# EAGLE design dabstick_eval_rev00 (EAGLE 6.6.0)

## Sheet 1 of 4: uC
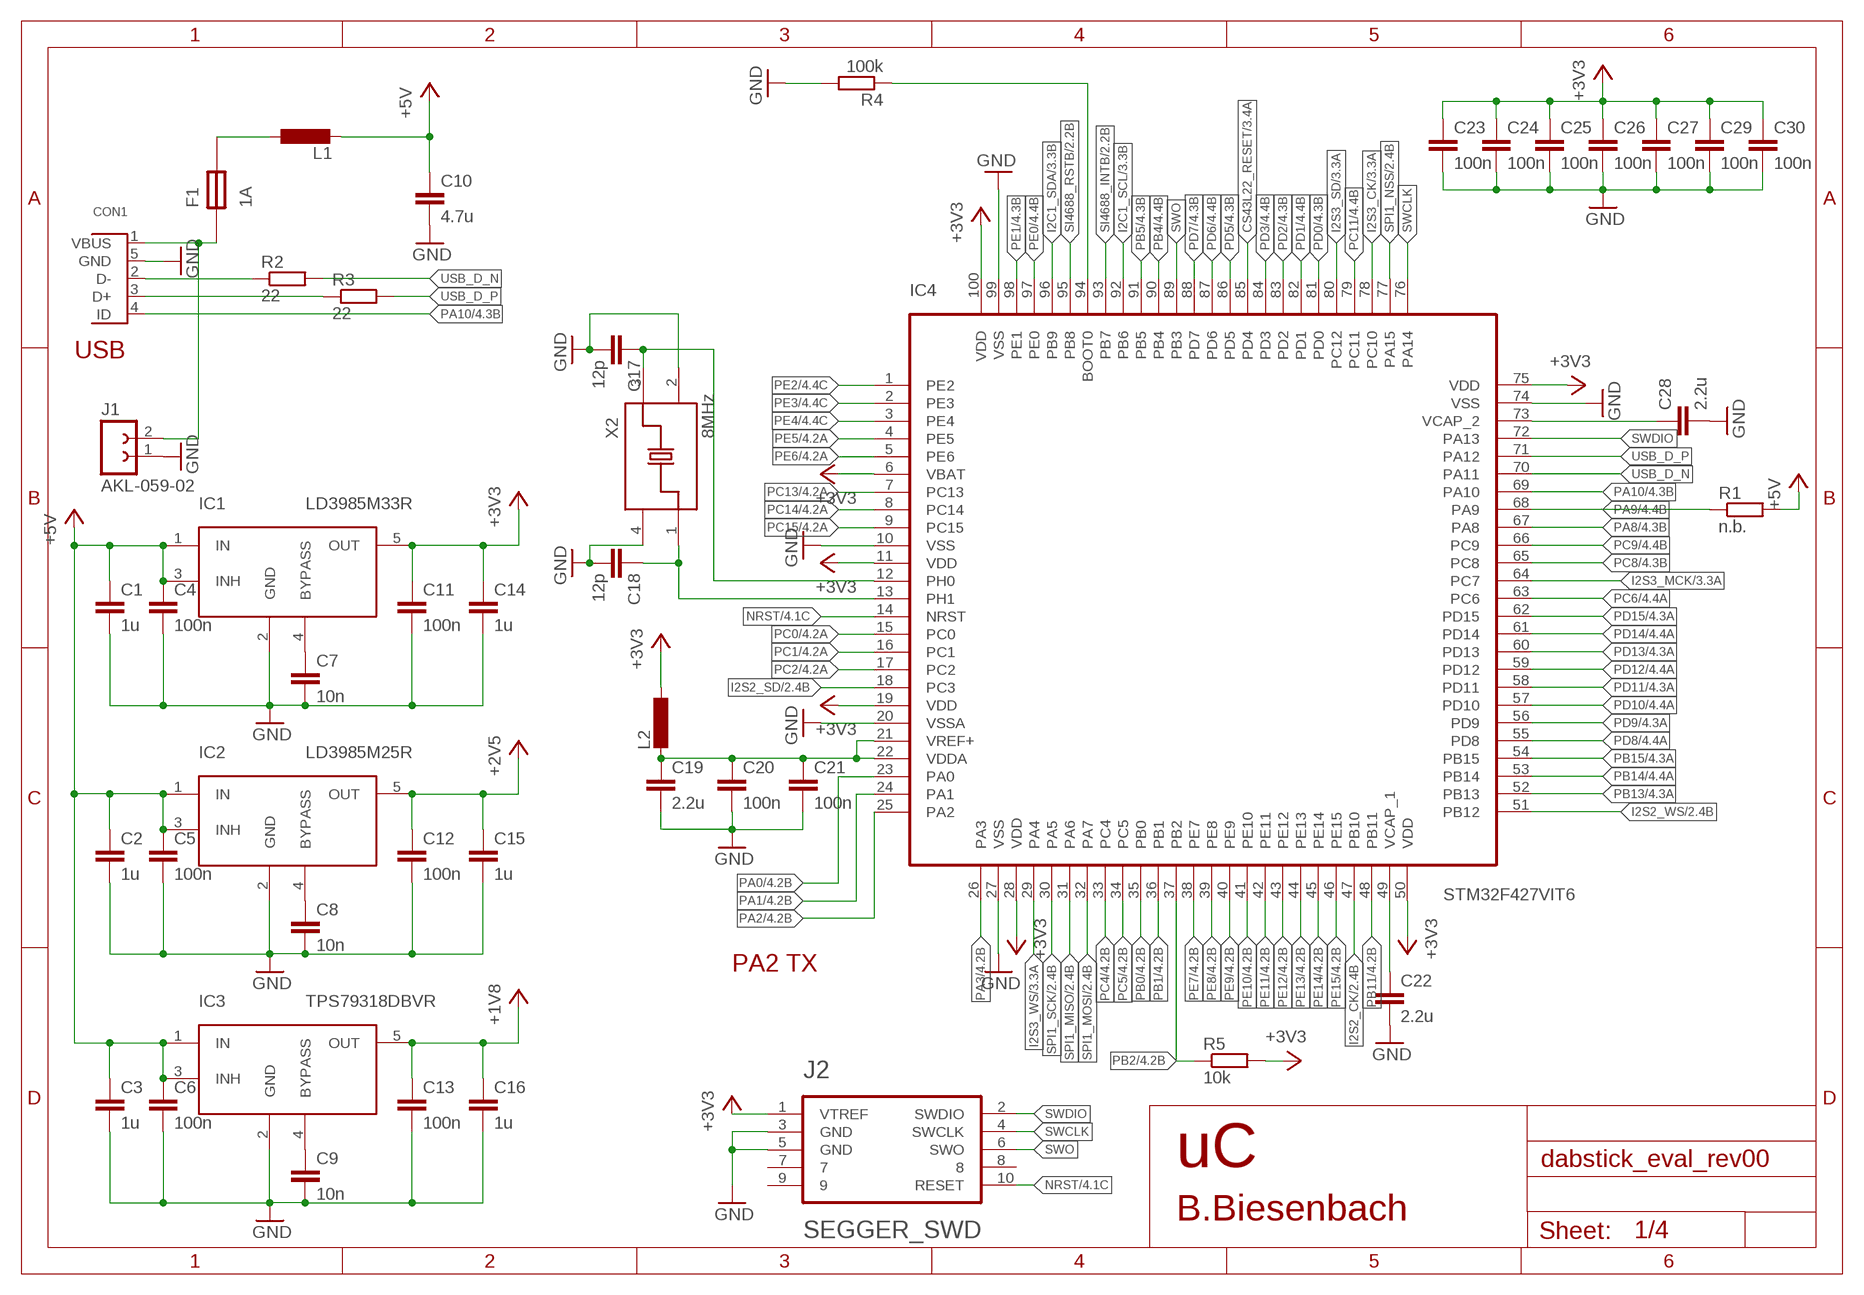
[diagram p0: schematic, sheet 1]

### Parts
C1  1u  C0603  [SMD0603]
C2  1u  C0603  [SMD0603]
C3  1u  C0603  [SMD0603]
C4  100n  C0603  [SMD0603]
C5  100n  C0603  [SMD0603]
C6  100n  C0603  [SMD0603]
C7  10n  C0603  [SMD0603]
C8  10n  C0603  [SMD0603]
C9  10n  C0603  [SMD0603]
C10  4.7u  C0805  [0805]
C11  100n  C0603  [SMD0603]
C12  100n  C0603  [SMD0603]
C13  100n  C0603  [SMD0603]
C14  1u  C0603  [SMD0603]
C15  1u  C0603  [SMD0603]
C16  1u  C0603  [SMD0603]
C17  12p  C0603  [SMD0603]
C18  12p  C0603  [SMD0603]
C19  2.2u  C0603  [SMD0603]
C20  100n  C0603  [SMD0603]
C21  100n  C0603  [SMD0603]
C22  2.2u  C0603  [SMD0603]
C23  100n  C0603  [SMD0603]
C24  100n  C0603  [SMD0603]
C25  100n  C0603  [SMD0603]
C26  100n  C0603  [SMD0603]
C27  100n  C0603  [SMD0603]
C28  2.2u  C0603  [SMD0603]
C29  100n  C0603  [SMD0603]
C30  100n  C0603  [SMD0603]
CON1  USB  [USB-B-MICRO-SMT]
F1  1A  SMD_FUSE  [SMD_FUSE]
IC1  LD3985M33R  [SOT23-5]
IC2  LD3985M25R  [SOT23-5]
IC3  TPS79318DBVR  [SOT23-5]
IC4  STM32F427VIT6  [LQFP100]
J1  AKL-059-02  [AKL-059-02]
J2  SEGGER_SWD  [HEADER_10_1.27]
L1  L08050805  [0805]
L2  L0603  [SMD0603]
R1  n.b.  R0603  [SMD0603]
R2  22  R0603  [SMD0603]
R3  22  R0603  [SMD0603]
R4  100k  R0603  [SMD0603]
R5  10k  R0603  [SMD0603]
X2  8MHz  XTAL_3.2X5  [XTAL_3.2X5]

### Nets
+1V8: C13.1 C16.1 IC3.5(OUT) ; also sheet 2
+2V5: C12.1 C15.1 IC2.5(OUT) ; also sheet 3
+3V3: C11.1 C14.1 C23.1 C24.1 C25.1 C26.1 C27.1 C29.1 C30.1 IC1.5(OUT) IC4.6(VBAT) IC4.11(VDD) IC4.19(VDD) IC4.28(VDD) IC4.50(VDD) IC4.75(VDD) IC4.100(VDD) J2.1(VTREF) L2.1 R5.2 ; also sheet 2,3,4
+5V: C1.1 C2.1 C3.1 C4.1 C5.1 C6.1 C10.1 IC1.1(IN) IC1.3(INH) IC2.1(IN) IC2.3(INH) IC3.1(IN) IC3.3(INH) L1.2 R1.2 ; also sheet 3,4
CS43L22_RESET: IC4.85(PD4) ; also sheet 3
GND: C1.2 C2.2 C3.2 C4.2 C5.2 C6.2 C7.2 C8.2 C9.2 C10.2 C11.2 C12.2 C13.2 C14.2 C15.2 C16.2 C17.2 C18.2 C19.2 C20.2 C21.2 C22.2 C23.2 C24.2 C25.2 C26.2 C27.2 C28.2 C29.2 C30.2 CON1.5(GND) IC1.2(GND) IC2.2(GND) IC3.2(GND) IC4.10(VSS) IC4.20(VSSA) IC4.27(VSS) IC4.74(VSS) IC4.99(VSS) J1.1 J2.3(GND) J2.5(GND) R4.2 X2.2(GND) X2.4(GND) ; also sheet 2,3,4
I2C1_SCL: IC4.92(PB6) ; also sheet 3
I2C1_SDA: IC4.96(PB9) ; also sheet 3
I2S2_CK: IC4.47(PB10) ; also sheet 2
I2S2_SD: IC4.18(PC3) ; also sheet 2
I2S2_WS: IC4.51(PB12) ; also sheet 2
I2S3_CK: IC4.78(PC10) ; also sheet 3
I2S3_MCK: IC4.64(PC7) ; also sheet 3
I2S3_SD: IC4.80(PC12) ; also sheet 3
I2S3_WS: IC4.29(PA4) ; also sheet 3
N$9: C7.1 IC1.4(BYPASS)
N$10: C8.1 IC2.4(BYPASS)
N$11: C9.1 IC3.4(BYPASS)
N$12: C19.1 C20.1 C21.1 IC4.21(VREF+) IC4.22(VDDA) L2.2
N$13: C28.1 IC4.73(VCAP_2)
N$14: C22.1 IC4.49(VCAP_1)
N$15: CON1.3(D+) R3.1
N$16: CON1.2(D-) R2.1
N$19: C18.1 IC4.13(PH1) X2.1
N$20: C17.1 IC4.12(PH0) X2.3
N$21: IC4.94(BOOT0) R4.1
N$30: F1.P$2 L1.1
N$31: CON1.1(VBUS) F1.P$1 J1.2
NRST: IC4.14(NRST) J2.10(RESET) ; also sheet 4
PA0: IC4.23(PA0) ; also sheet 4
PA1: IC4.24(PA1) ; also sheet 4
PA2: IC4.25(PA2) ; also sheet 4
PA3: IC4.26(PA3) ; also sheet 4
PA8: IC4.67(PA8) ; also sheet 4
PA9: IC4.68(PA9) R1.1 ; also sheet 4
PA10: CON1.4(ID) IC4.69(PA10) ; also sheet 4
PB0: IC4.35(PB0) ; also sheet 4
PB1: IC4.36(PB1) ; also sheet 4
PB2: IC4.37(PB2) R5.1 ; also sheet 4
PB4: IC4.90(PB4) ; also sheet 4
PB5: IC4.91(PB5) ; also sheet 4
PB11: IC4.48(PB11) ; also sheet 4
PB13: IC4.52(PB13) ; also sheet 4
PB14: IC4.53(PB14) ; also sheet 4
PB15: IC4.54(PB15) ; also sheet 4
PC0: IC4.15(PC0) ; also sheet 4
PC1: IC4.16(PC1) ; also sheet 4
PC2: IC4.17(PC2) ; also sheet 4
PC4: IC4.33(PC4) ; also sheet 4
PC5: IC4.34(PC5) ; also sheet 4
PC6: IC4.63(PC6) ; also sheet 4
PC8: IC4.65(PC8) ; also sheet 4
PC9: IC4.66(PC9) ; also sheet 4
PC11: IC4.79(PC11) ; also sheet 4
PC13: IC4.7(PC13) ; also sheet 4
PC14: IC4.8(PC14) ; also sheet 4
PC15: IC4.9(PC15) ; also sheet 4
PD0: IC4.81(PD0) ; also sheet 4
PD1: IC4.82(PD1) ; also sheet 4
PD2: IC4.83(PD2) ; also sheet 4
PD3: IC4.84(PD3) ; also sheet 4
PD5: IC4.86(PD5) ; also sheet 4
PD6: IC4.87(PD6) ; also sheet 4
PD7: IC4.88(PD7) ; also sheet 4
PD8: IC4.55(PD8) ; also sheet 4
PD9: IC4.56(PD9) ; also sheet 4
PD10: IC4.57(PD10) ; also sheet 4
PD11: IC4.58(PD11) ; also sheet 4
PD12: IC4.59(PD12) ; also sheet 4
PD13: IC4.60(PD13) ; also sheet 4
PD14: IC4.61(PD14) ; also sheet 4
PD15: IC4.62(PD15) ; also sheet 4
PE0: IC4.97(PE0) ; also sheet 4
PE1: IC4.98(PE1) ; also sheet 4
PE2: IC4.1(PE2) ; also sheet 4
PE3: IC4.2(PE3) ; also sheet 4
PE4: IC4.3(PE4) ; also sheet 4
PE5: IC4.4(PE5) ; also sheet 4
PE6: IC4.5(PE6) ; also sheet 4
PE7: IC4.38(PE7) ; also sheet 4
PE8: IC4.39(PE8) ; also sheet 4
PE9: IC4.40(PE9) ; also sheet 4
PE10: IC4.41(PE10) ; also sheet 4
PE11: IC4.42(PE11) ; also sheet 4
PE12: IC4.43(PE12) ; also sheet 4
PE13: IC4.44(PE13) ; also sheet 4
PE14: IC4.45(PE14) ; also sheet 4
PE15: IC4.46(PE15) ; also sheet 4
SI4688_INTB: IC4.93(PB7) ; also sheet 2
SI4688_RSTB: IC4.95(PB8) ; also sheet 2
SPI1_MISO: IC4.31(PA6) ; also sheet 2
SPI1_MOSI: IC4.32(PA7) ; also sheet 2
SPI1_NSS: IC4.77(PA15) ; also sheet 2
SPI1_SCK: IC4.30(PA5) ; also sheet 2
SWCLK: IC4.76(PA14) J2.4(SWCLK)
SWDIO: IC4.72(PA13) J2.2(SWDIO)
SWO: IC4.89(PB3) J2.6(SWO)
USB_D_N: IC4.70(PA11) R2.2
USB_D_P: IC4.71(PA12) R3.2
Unconnected: J2.7 J2.8 J2.9

### Notes on the sheet
- PA2 TX
- uC
- B.Biesenbach

## Sheet 2 of 4: DAB
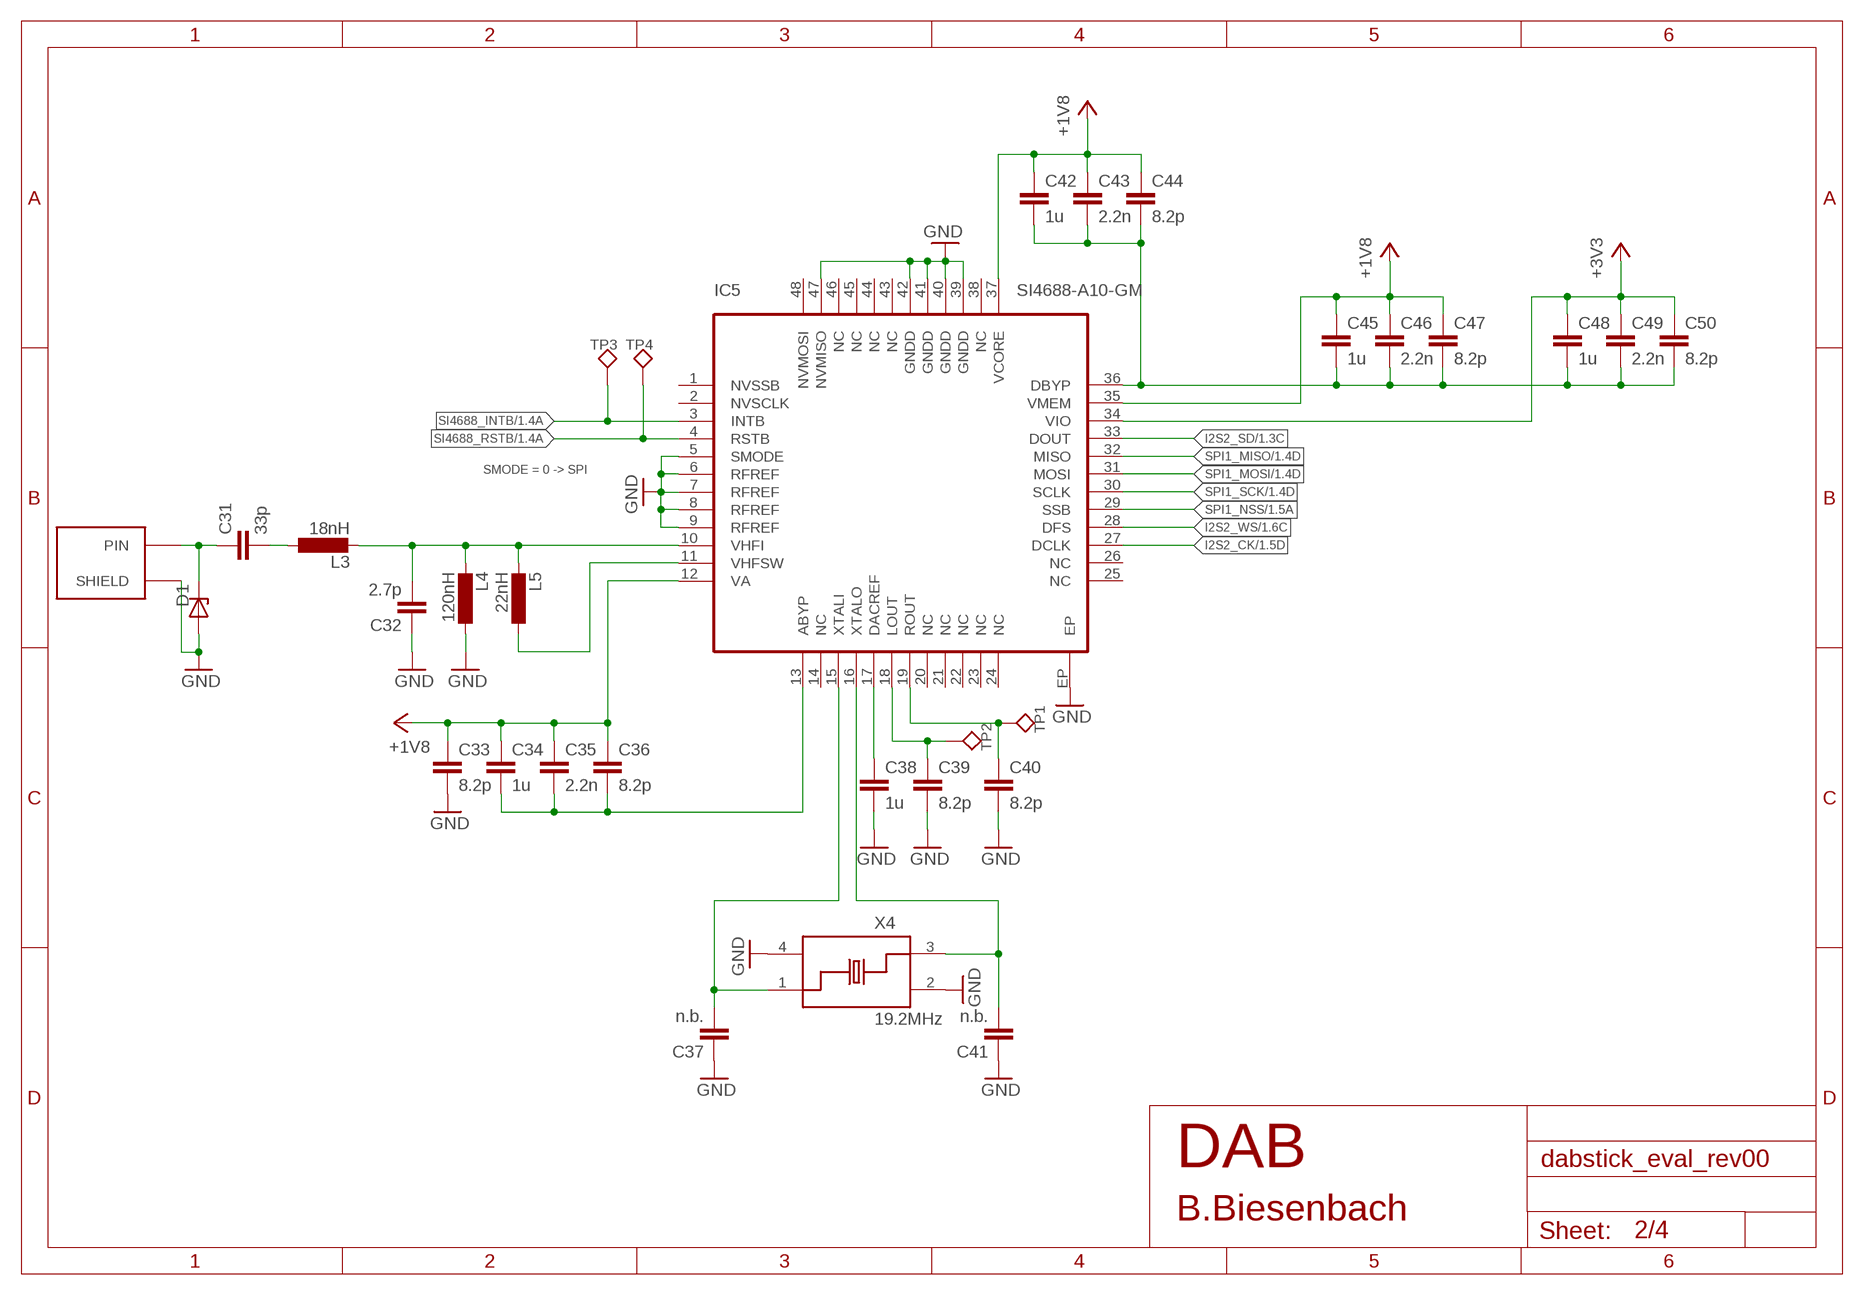
[diagram p1: schematic, sheet 2]

### Parts
C31  33p  C0402  [SMD0402]
C32  2.7p  C0402  [SMD0402]
C33  8.2p  C0603  [SMD0603]
C34  1u  C0603  [SMD0603]
C35  2.2n  C0603  [SMD0603]
C36  8.2p  C0603  [SMD0603]
C37  n.b.  C0402  [SMD0402]
C38  1u  C0603  [SMD0603]
C39  8.2p  C0603  [SMD0603]
C40  8.2p  C0603  [SMD0603]
C41  n.b.  C0402  [SMD0402]
C42  1u  C0603  [SMD0603]
C43  2.2n  C0603  [SMD0603]
C44  8.2p  C0603  [SMD0603]
C45  1u  C0603  [SMD0603]
C46  2.2n  C0603  [SMD0603]
C47  8.2p  C0603  [SMD0603]
C48  1u  C0603  [SMD0603]
C49  2.2n  C0603  [SMD0603]
C50  8.2p  C0603  [SMD0603]
D1  ESD9L5.0  [SOD923]
IC5  SI4688-A10-GM  [QFN48]
L3  18nH  L0402  [SMD0402]
L4  120nH  L0402  [SMD0402]
L5  22nH  L0402  [SMD0402]
TP1  TP-2-MM  [TP-2-MM]
TP2  TP-2-MM  [TP-2-MM]
TP3  TP-1-MM  [TP-1-MM]
TP4  TP-1-MM  [TP-1-MM]
X3  SMA_LP_1.57MM  [SMA_LP_1.57MM]
X4  19.2MHz  XTAL_3.2X2.5  [XTAL_3.2X2.5]

### Nets
+1V8: C33.1 C34.1 C35.1 C36.1 C42.1 C43.1 C44.1 C45.1 C46.1 C47.1 IC5.12(VA) IC5.35(VMEM) IC5.37(VCORE) ; also sheet 1
+3V3: C48.1 C49.1 C50.1 IC5.34(VIO) ; also sheet 1,3,4
GND: C32.1 C33.2 C37.1 C38.2 C39.2 C40.2 C41.1 D1.A IC5.5(SMODE) IC5.6(RFREF) IC5.7(RFREF) IC5.8(RFREF) IC5.9(RFREF) IC5.39(GNDD) IC5.40(GNDD) IC5.41(GNDD) IC5.42(GNDD) IC5.47(NVMISO) IC5.EP L4.1 X3.GND(SHIELD) X3.GND@1(SHIELD) X3.GND@2(SHIELD) X3.GND@3(SHIELD) X4.2(GND) X4.4(GND) ; also sheet 1,3,4
I2S2_CK: IC5.27(DCLK) ; also sheet 1
I2S2_SD: IC5.33(DOUT) ; also sheet 1
I2S2_WS: IC5.28(DFS) ; also sheet 1
N$1: C31.2 L3.1
N$2: C32.2 IC5.10(VHFI) L3.2 L4.2 L5.2
N$3: IC5.11(VHFSW) L5.1
N$4: C34.2 C35.2 C36.2 IC5.13(ABYP)
N$5: C42.2 C43.2 C44.2 C45.2 C46.2 C47.2 C48.2 C49.2 C50.2 IC5.36(DBYP)
N$6: C37.2 IC5.15(XTALI) X4.1
N$7: C41.2 IC5.16(XTALO) X4.3
N$8: C38.1 IC5.17(DACREF)
RF_IN: C31.1 D1.K(C) X3.PIN
SI4688_INTB: IC5.3(INTB) TP3.1(TP) ; also sheet 1
SI4688_LOUT: C39.1 IC5.18(LOUT) TP2.P$1(TP)
SI4688_ROUT: C40.1 IC5.19(ROUT) TP1.P$1(TP)
SI4688_RSTB: IC5.4(RSTB) TP4.1(TP) ; also sheet 1
SPI1_MISO: IC5.32(MISO) ; also sheet 1
SPI1_MOSI: IC5.31(MOSI) ; also sheet 1
SPI1_NSS: IC5.29(SSB) ; also sheet 1
SPI1_SCK: IC5.30(SCLK) ; also sheet 1
Unconnected: IC5.1(NVSSB) IC5.2(NVSCLK) IC5.14(NC) IC5.20(NC) IC5.21(NC) IC5.22(NC) IC5.23(NC) IC5.24(NC) IC5.25(NC) IC5.26(NC) IC5.38(NC) IC5.43(NC) IC5.44(NC) IC5.45(NC) IC5.46(NC) IC5.48(NVMOSI)

### Notes on the sheet
- SMODE = 0 -> SPI
- DAB
- B.Biesenbach

## Sheet 3 of 4: Audio
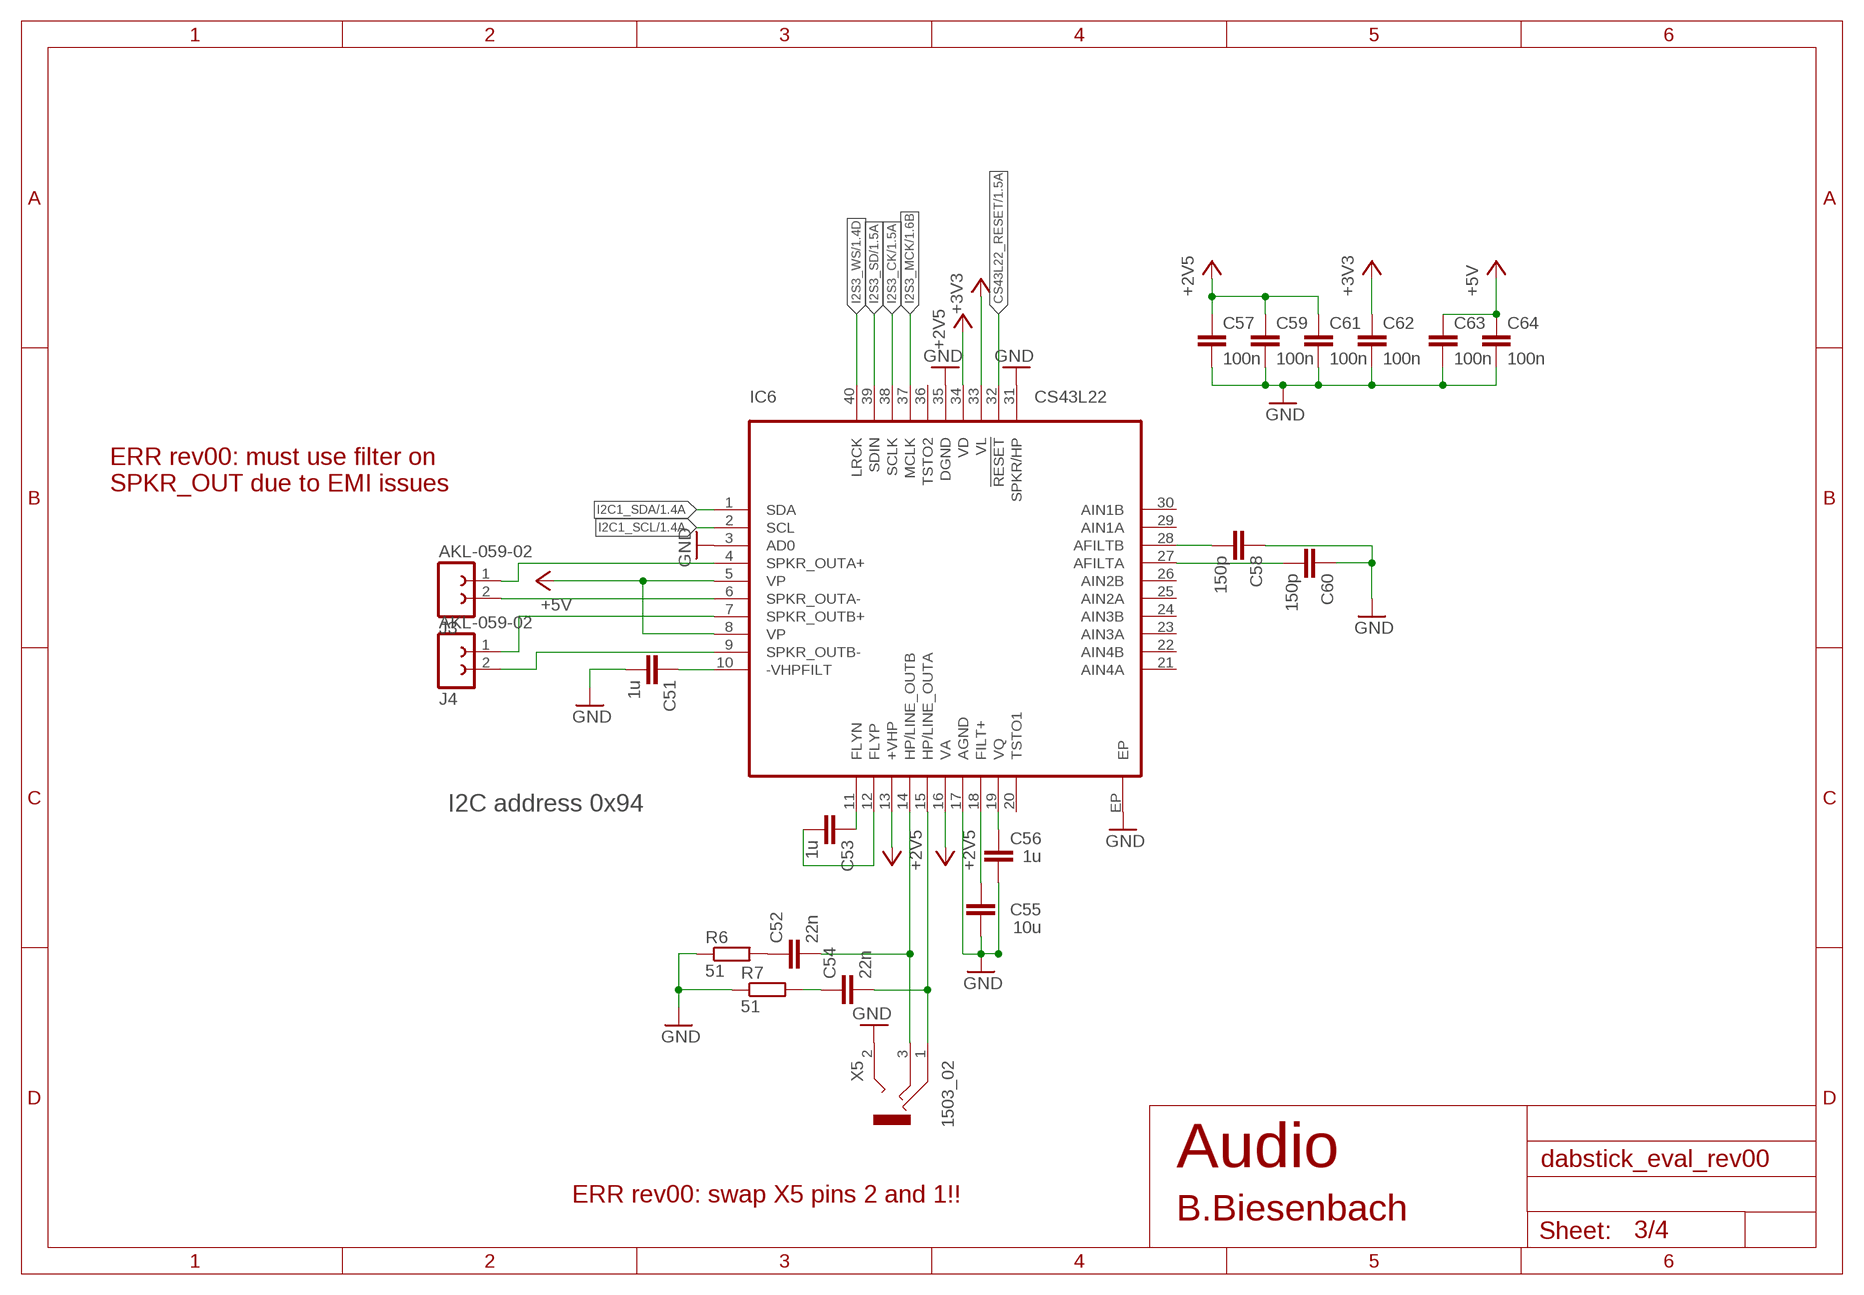
[diagram p2: schematic, sheet 3]

### Parts
C51  1u  C0603  [SMD0603]
C52  22n  C0603  [SMD0603]
C53  1u  C0603  [SMD0603]
C54  22n  C0603  [SMD0603]
C55  10u  C0603  [SMD0603]
C56  1u  C0603  [SMD0603]
C57  100n  C0603  [SMD0603]
C58  150p  C0603  [SMD0603]
C59  100n  C0603  [SMD0603]
C60  150p  C0603  [SMD0603]
C61  100n  C0603  [SMD0603]
C62  100n  C0603  [SMD0603]
C63  100n  C0603  [SMD0603]
C64  100n  C0603  [SMD0603]
IC6  CS43L22  [QFN40]
J3  AKL-059-02  [AKL-059-02]
J4  AKL-059-02  [AKL-059-02]
R6  51  R0603  [SMD0603]
R7  51  R0603  [SMD0603]
X5  1503_02  [1503_02]

### Nets
+2V5: C57.1 C59.1 C61.1 IC6.13(+VHP) IC6.16(VA) IC6.34(VD) ; also sheet 1
+3V3: C62.1 IC6.33(VL) ; also sheet 1,2,4
+5V: C63.1 C64.1 IC6.5(VP) IC6.8(VP) ; also sheet 1,4
CS43L22_RESET: IC6.32(!RESET) ; also sheet 1
GND: C51.2 C55.1 C56.1 C57.2 C58.1 C59.2 C60.1 C61.2 C62.2 C63.2 C64.2 IC6.3(AD0) IC6.17(AGND) IC6.31(SPKR/HP) IC6.35(DGND) IC6.EP R6.1 R7.1 X5.2 ; also sheet 1,2,4
I2C1_SCL: IC6.2(SCL) ; also sheet 1
I2C1_SDA: IC6.1(SDA) ; also sheet 1
I2S3_CK: IC6.38(SCLK) ; also sheet 1
I2S3_MCK: IC6.37(MCLK) ; also sheet 1
I2S3_SD: IC6.39(SDIN) ; also sheet 1
I2S3_WS: IC6.40(LRCK) ; also sheet 1
N$32: IC6.4(SPKR_OUTA+) J3.1
N$33: IC6.6(SPKR_OUTA-) J3.2
N$34: IC6.7(SPKR_OUTB+) J4.1
N$64: IC6.9(SPKR_OUTB-) J4.2
N$66: C54.2 IC6.15(HP/LINE_OUTA) X5.1
N$67: C52.2 IC6.14(HP/LINE_OUTB) X5.3
N$69: C52.1 R6.2
N$71: C54.1 R7.2
N$72: C56.2 IC6.19(VQ)
N$73: C55.2 IC6.18(FILT+)
N$74: C58.2 IC6.28(AFILTB)
N$75: C60.2 IC6.27(AFILTA)
N$76: C51.1 IC6.10(-VHPFILT)
N$77: C53.1 IC6.11(FLYN)
N$78: C53.2 IC6.12(FLYP)
Unconnected: IC6.20(TSTO1) IC6.21(AIN4A) IC6.22(AIN4B) IC6.23(AIN3A) IC6.24(AIN3B) IC6.25(AIN2A) IC6.26(AIN2B) IC6.29(AIN1A) IC6.30(AIN1B) IC6.36(TSTO2) X5.2@2

### Notes on the sheet
- ERR rev00: must use filter on
  SPKR_OUT due to EMI issues
- I2C address 0x94
- Audio
- ERR rev00: swap X5 pins 2 and 1!!
- B.Biesenbach

## Sheet 4 of 4: Extension Header
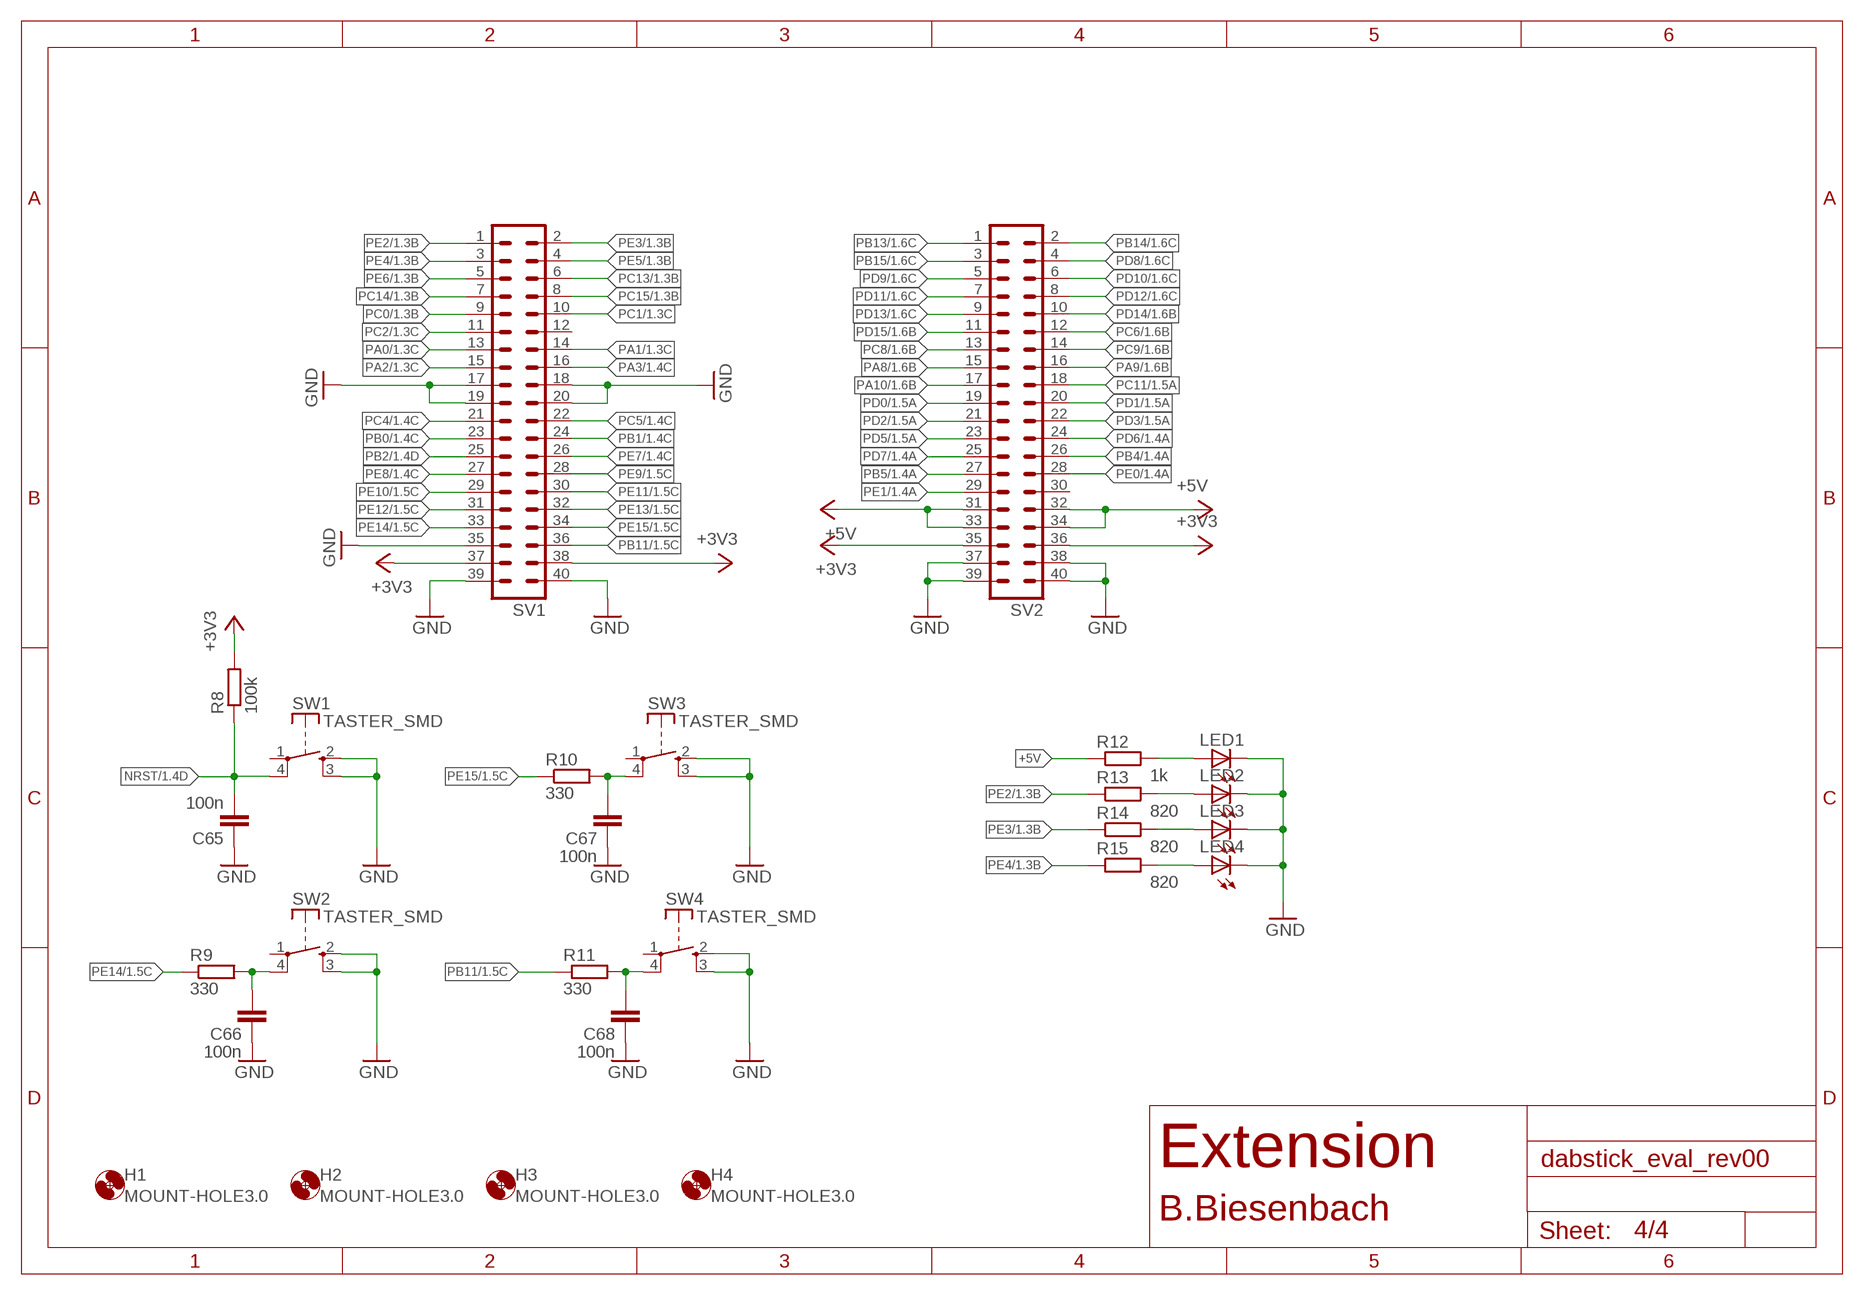
[diagram p3: schematic, sheet 4]

### Parts
C65  100n  C0603  [SMD0603]
C66  100n  C0603  [SMD0603]
C67  100n  C0603  [SMD0603]
C68  100n  C0603  [SMD0603]
H1  MOUNT-HOLE3.0  [3,0]
H2  MOUNT-HOLE3.0  [3,0]
H3  MOUNT-HOLE3.0  [3,0]
H4  MOUNT-HOLE3.0  [3,0]
LED1  LEDCHIPLED_0603  [CHIPLED_0603]
LED2  LEDCHIPLED_0603  [CHIPLED_0603]
LED3  LEDCHIPLED_0603  [CHIPLED_0603]
LED4  LEDCHIPLED_0603  [CHIPLED_0603]
R8  100k  R0603  [SMD0603]
R9  330  R0603  [SMD0603]
R10  330  R0603  [SMD0603]
R11  330  R0603  [SMD0603]
R12  1k  R0603  [SMD0603]
R13  820  R0603  [SMD0603]
R14  820  R0603  [SMD0603]
R15  820  R0603  [SMD0603]
SV1  MA20-2  [MA20-2]
SV2  MA20-2  [MA20-2]
SW1  TASTER_SMD  [TASTER_SMD_ALPS]
SW2  TASTER_SMD  [TASTER_SMD_ALPS]
SW3  TASTER_SMD  [TASTER_SMD_ALPS]
SW4  TASTER_SMD  [TASTER_SMD_ALPS]

### Nets
+3V3: R8.2 SV1.37 SV1.38 SV2.35 SV2.36 ; also sheet 1,2,3
+5V: R12.1 SV2.31 SV2.32 SV2.33 SV2.34 ; also sheet 1,3
GND: C65.1 C66.1 C67.1 C68.1 LED1.C LED2.C LED3.C LED4.C SV1.17 SV1.18 SV1.19 SV1.20 SV1.35 SV1.39 SV1.40 SV2.37 SV2.38 SV2.39 SV2.40 SW1.2(S) SW1.3(S) SW2.2(S) SW2.3(S) SW3.2(S) SW3.3(S) SW4.2(S) SW4.3(S) ; also sheet 1,2,3
N$22: C66.2 R9.2 SW2.4(P)
N$23: C68.2 R11.2 SW4.4(P)
N$24: C67.2 R10.2 SW3.4(P)
N$26: LED1.A R12.2
N$27: LED2.A R13.2
N$28: LED3.A R14.2
N$29: LED4.A R15.2
NRST: C65.2 R8.1 SW1.4(P) ; also sheet 1
PA0: SV1.13 ; also sheet 1
PA1: SV1.14 ; also sheet 1
PA2: SV1.15 ; also sheet 1
PA3: SV1.16 ; also sheet 1
PA8: SV2.15 ; also sheet 1
PA9: SV2.16 ; also sheet 1
PA10: SV2.17 ; also sheet 1
PB0: SV1.23 ; also sheet 1
PB1: SV1.24 ; also sheet 1
PB2: SV1.25 ; also sheet 1
PB4: SV2.26 ; also sheet 1
PB5: SV2.27 ; also sheet 1
PB11: R11.1 SV1.36 ; also sheet 1
PB13: SV2.1 ; also sheet 1
PB14: SV2.2 ; also sheet 1
PB15: SV2.3 ; also sheet 1
PC0: SV1.9 ; also sheet 1
PC1: SV1.10 ; also sheet 1
PC2: SV1.11 ; also sheet 1
PC4: SV1.21 ; also sheet 1
PC5: SV1.22 ; also sheet 1
PC6: SV2.12 ; also sheet 1
PC8: SV2.13 ; also sheet 1
PC9: SV2.14 ; also sheet 1
PC11: SV2.18 ; also sheet 1
PC13: SV1.6 ; also sheet 1
PC14: SV1.7 ; also sheet 1
PC15: SV1.8 ; also sheet 1
PD0: SV2.19 ; also sheet 1
PD1: SV2.20 ; also sheet 1
PD2: SV2.21 ; also sheet 1
PD3: SV2.22 ; also sheet 1
PD5: SV2.23 ; also sheet 1
PD6: SV2.24 ; also sheet 1
PD7: SV2.25 ; also sheet 1
PD8: SV2.4 ; also sheet 1
PD9: SV2.5 ; also sheet 1
PD10: SV2.6 ; also sheet 1
PD11: SV2.7 ; also sheet 1
PD12: SV2.8 ; also sheet 1
PD13: SV2.9 ; also sheet 1
PD14: SV2.10 ; also sheet 1
PD15: SV2.11 ; also sheet 1
PE0: SV2.28 ; also sheet 1
PE1: SV2.29 ; also sheet 1
PE2: R13.1 SV1.1 ; also sheet 1
PE3: R14.1 SV1.2 ; also sheet 1
PE4: R15.1 SV1.3 ; also sheet 1
PE5: SV1.4 ; also sheet 1
PE6: SV1.5 ; also sheet 1
PE7: SV1.26 ; also sheet 1
PE8: SV1.27 ; also sheet 1
PE9: SV1.28 ; also sheet 1
PE10: SV1.29 ; also sheet 1
PE11: SV1.30 ; also sheet 1
PE12: SV1.31 ; also sheet 1
PE13: SV1.32 ; also sheet 1
PE14: R9.1 SV1.33 ; also sheet 1
PE15: R10.1 SV1.34 ; also sheet 1
Unconnected: SV1.12 SV2.30 SW1.1(P) SW2.1(P) SW3.1(P) SW4.1(P)

### Notes on the sheet
- Extension
- B.Biesenbach

## Library data of the parts
C1-C9 C11-C30 C33-C36 C38-C40 C42-C68 = generisch:C0603
C10 = generisch:C0805
C31 C32 C37 C41 = generisch:C0402
CON1 = con-usb:USB
D1 = generisch:ESD9L5.0
F1 = smd_fuse:SMD_FUSE
H1-H4 = holes:MOUNT-HOLE: MOUNTING HOLE with drill center marker
IC1 = ldo_reg:LD3985M33R
IC2 = ldo_reg:LD3985M25R
IC3 = ldo_reg:TPS79318DBVR
IC4 = stm32f42x:STM32F427VIT6
IC5 = SI4688-A10-GM:SI4688-A10-GM
IC6 = cs43l22:CS43L22
J1 J3 J4 = ria-akl059:AKL-059-02
J2 = generisch:SEGGER_SWD
L1 = generisch:L0805
L2 = generisch:L0603
L3-L5 = generisch:L0402
LED1-LED4 = led:LED: LED OSRAM: - CHIPLED LG R971, LG N971, LY N971, LG Q971, LY Q971, LO R971, LY R971 LH N974, LH R974 LS Q976, LO Q976, LY Q976 LO Q996 - Hyper CHIPLED LW Q18S LB Q993, LB Q99A, LB R99A - SideLED LS A670, LO A670, LY A670, LG A670, LP A670 LB A673, LV A673, LT A673, LW A673 LH A674 LY A675 LS A676, LA A676, LO A676, LY A676, LW A676 LS A679, LY A679, LG A679 - Hyper Micro SIDELED® LS Y876, LA Y876, LO Y876, LY Y876 LT Y87S - SmartLED LW L88C, LW L88S LB L89C, LB L89S, LG L890 LS L89K, LO L89K, LY L89K LS L896, LA L896, LO L896, LY L896 - TOPLED LS T670, LO T670, LY T670, LG T670, LP T670 LSG T670, LSP T670, LSY T670, LOP T670, LYG T670 LG T671, LOG T671, LSG T671 LB T673, LV T673, LT T673, LW T673 LH T674 LS T676, LA T676, LO T676, LY T676, LB T676, LH T676, LSB T676, LW T676 LB T67C, LV T67C, LT T67C, LS T67K, LO T67K, LY T67K, LW E67C LS E67B, LA E67B, LO E67B, LY E67B, LB E67C, LV E67C, LT E67C LW T67C LS T679, LY T679, LG T679 LS T770, LO T770, LY T770, LG T770, LP T770 LB T773, LV T773, LT T773, LW T773 LH T774 LS E675, LA E675, LY E675, LS T675 LS T776, LA T776, LO T776, LY T776, LB T776 LHGB T686 LT T68C, LB T68C - Hyper Mini TOPLED® LB M676 - Mini TOPLED Santana® LG M470 LS M47K, LO M47K, LY M47K Source: http://www.osram.convergy.de LUXEON: - LUMILED® LXK2-PW12-R00, LXK2-PW12-S00, LXK2-PW14-U00, LXK2-PW14-V00 LXK2-PM12-R00, LXK2-PM12-S00, LXK2-PM14-U00 LXK2-PE12-Q00, LXK2-PE12-R00, LXK2-PE12-S00, LXK2-PE14-T00, LXK2-PE14-U00 LXK2-PB12-K00, LXK2-PB12-L00, LXK2-PB12-M00, LXK2-PB14-N00, LXK2-PB14-P00, LXK2-PB14-Q00 LXK2-PR12-L00, LXK2-PR12-M00, LXK2-PR14-Q00, LXK2-PR14-R00 LXK2-PD12-Q00, LXK2-PD12-R00, LXK2-PD12-S00 LXK2-PH12-R00, LXK2-PH12-S00 LXK2-PL12-P00, LXK2-PL12-Q00, LXK2-PL12-R00 Source: www.luxeon.com KINGBRIGHT: KA-3528ASYC Source: www.kingbright.com
R1-R15 = generisch:R0603
SV1 SV2 = con-lstb:MA20-2: PIN HEADER; OC_FARNELL: unknown; OC_NEWARK: unknown
SW1-SW4 = generisch:TASTER_SMD
TP1-TP4 = generisch:TP
X2 = generisch:XTAL_3.2X5
X3 = con_sma:SMA_LP_1.57MM: Abschlussbuchse SMA LP rund 1,57mm RS 526-5785
X4 = generisch:XTAL_3.2X2.5
X5 = con-lumberg:1503_02: Jack connectors according to JISC 6560, 3.5 mm Klinkeneinbaukupplung nach JISC 6560, 3,5 mm, 3-polig/stereo, abgewinkelte Ausführung, Surface-Mount-Technik (SMT) Source: http://www.lumberg.com/Produkte/PDFs/1503_02.pdf; OC_FARNELL: 1216979; OC_NEWARK: unknown

## Board
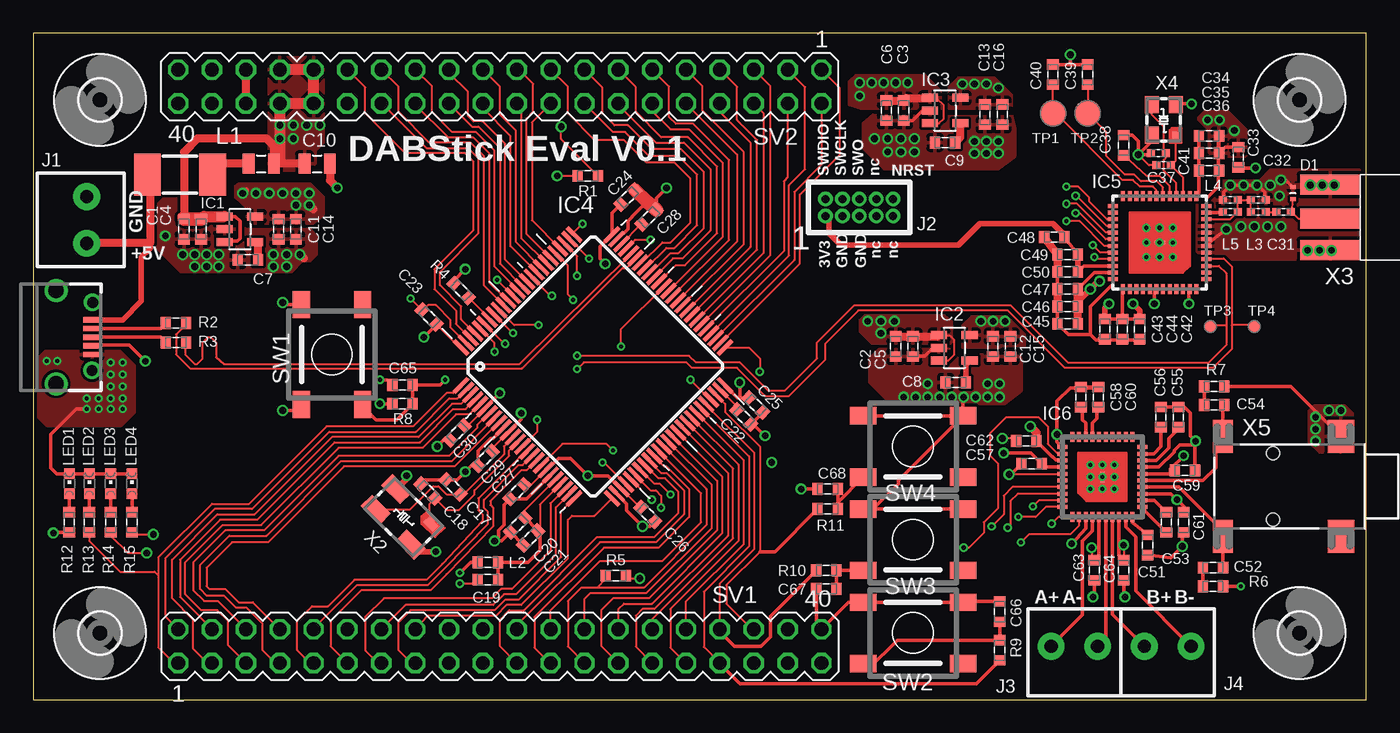
[diagram p4: board, top side]
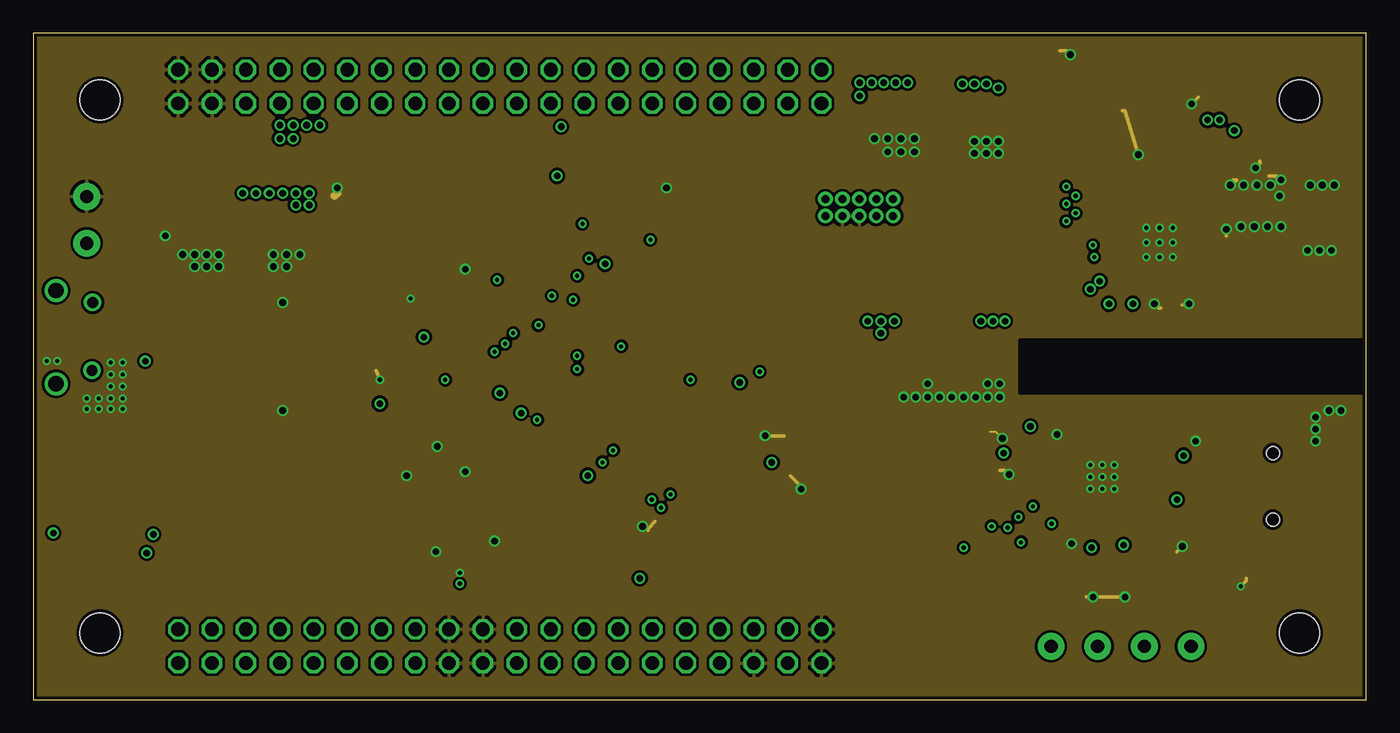
[diagram p5: board, inner layer Route2]
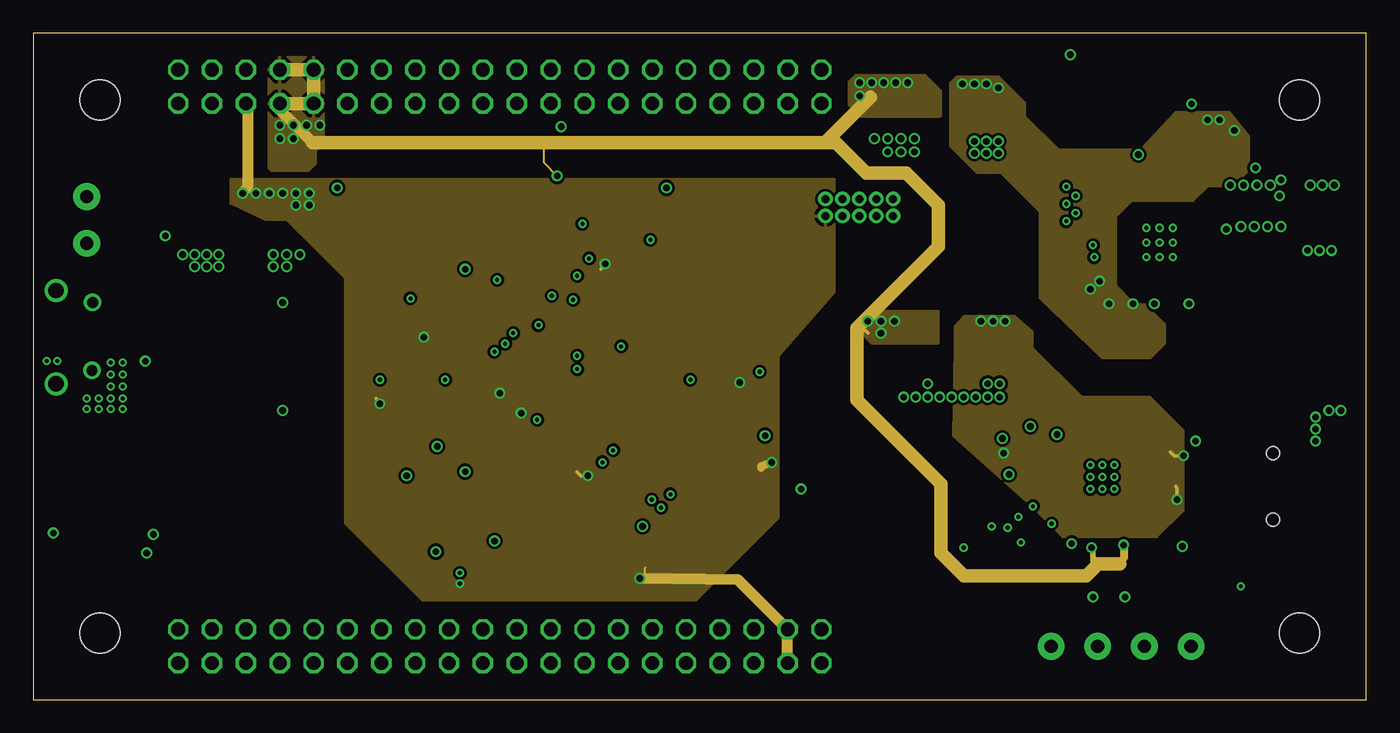
[diagram p6: board, inner layer Route15]
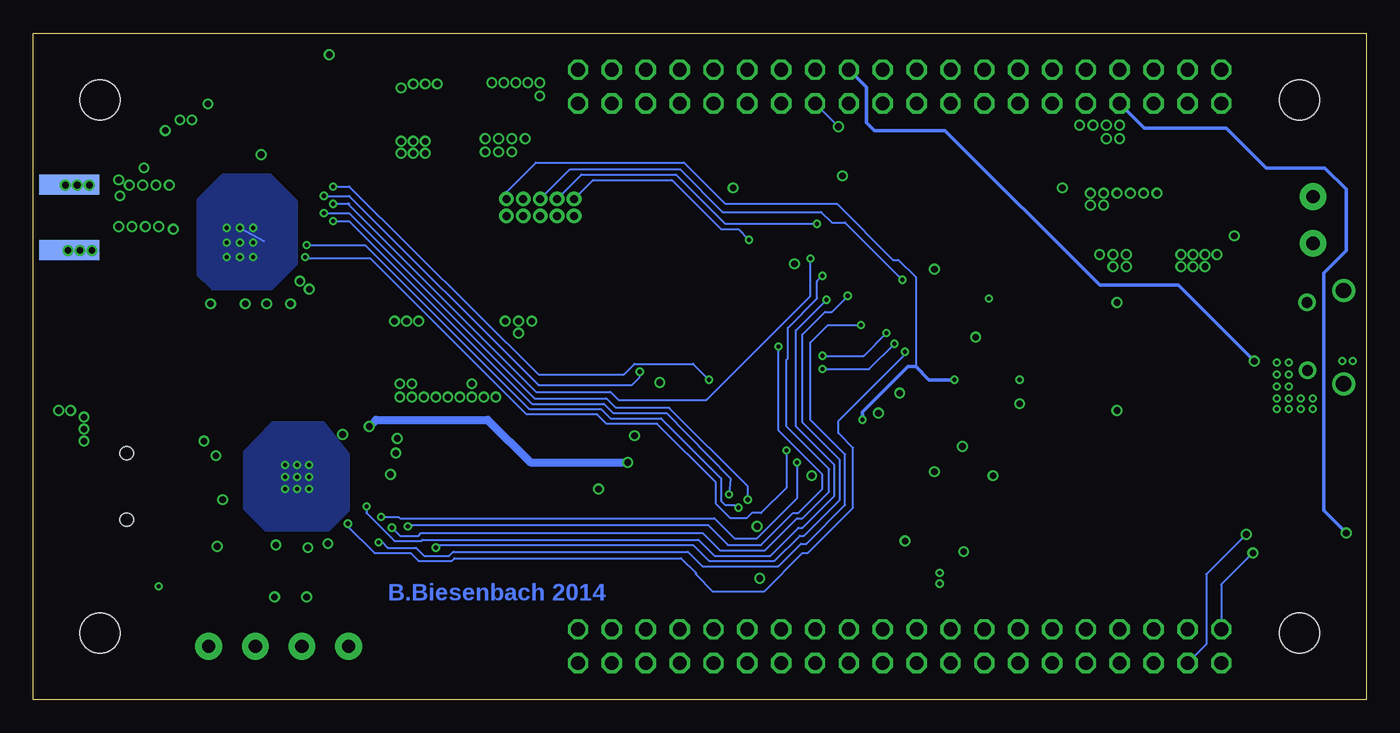
[diagram p7: board, bottom side, seen from below]

Size 100 x 50 mm. Coordinates in mm from the lower left corner, seen from the top.
Outline: 0,0 100,0 100,50 0,50 0,0
Copper layers (1*2*15*16): Top 0.035mm / dielectric 0.2mm / Route2 0.017mm / dielectric 1.2mm / Route15 0.017mm / dielectric 0.2mm / Bottom 0.035mm
Design rules "Elecrow_4-layer_design_rules *": minimum track width 6mil, minimum drill 12mil, track to track 6mil, track to pad 6mil, pad to pad 6mil, via to via 6mil, smd to smd 0mil, copper to edge 10mil, drill to drill 10mil, minimum pad ring 10mil, minimum via ring 6mil, stop-mask expansion 2mil, vias tented up to drill 10mil, thermal gap 10mil

### Footprints (pad centres in the part's own frame; a part is rotated, then mirrored left to right if it is on the bottom)
SMD0603 = smd 0.762 x 0.889: 1 -0.762,0; 2 0.762,0
0805 = smd 0.894 x 1.5: 1 -0.95,0; 2 0.95,0
SMD0402 = smd 0.6 x 0.6: 1 -0.55,0; 2 0.55,0
USB-B-MICRO-SMT = smd 0.4 x 1.35: 1 -1.3,2.7; 2 -0.65,2.7; 3 0,2.7; 4 0.65,2.7; 5 1.3,2.7 | drill 0.8 pad 1.2: P$1 2.5,2.7; P$2 -2.6,2.75 | drill 1.15 pad 1.5: P$3 -3.5,0; P$4 3.5,0
SOD923 = smd 0.3 x 0.4: A -0.45,0; K 0.45,0
SMD_FUSE = smd 2 x 3.15: P$1 -2.45,0; P$2 2.45,0
3,0 = hole 3: 0,0
SOT23-5 = smd 0.6 x 1.2: 1 -0.95,-1.15; 2 0,-1.15; 3 0.95,-1.15; 4 0.95,1.15; 5 -0.95,1.15
LQFP100 = smd 1.5 x 0.3: 1 -8,6; 2 -8,5.5; 3 -8,5; 4 -8,4.5; 5 -8,4; 6 -8,3.5; 7 -8,3; 8 -8,2.5; 9 -8,2; 10 -8,1.5; 11 -8,1; 12 -8,0.5; 13 -8,0; 14 -8,-0.5; 15 -8,-1; 16 -8,-1.5; 17 -8,-2; 18 -8,-2.5; 19 -8,-3; 20 -8,-3.5; 21 -8,-4; 22 -8,-4.5; 23 -8,-5; 24 -8,-5.5; 25 -8,-6; 51 8,-6; 52 8,-5.5; 53 8,-5; 54 8,-4.5; 55 8,-4; 56 8,-3.5; 57 8,-3; 58 8,-2.5; 59 8,-2; 60 8,-1.5; 61 8,-1; 62 8,-0.5; 63 8,0; 64 8,0.5; 65 8,1; 66 8,1.5; 67 8,2; 68 8,2.5; 69 8,3; 70 8,3.5; 71 8,4; 72 8,4.5; 73 8,5; 74 8,5.5; 75 8,6 | smd 0.3 x 1.5: 26 -6,-8; 27 -5.5,-8; 28 -5,-8; 29 -4.5,-8; 30 -4,-8; 31 -3.5,-8; 32 -3,-8; 33 -2.5,-8; 34 -2,-8; 35 -1.5,-8; 36 -1,-8; 37 -0.5,-8; 38 0,-8; 39 0.5,-8; 40 1,-8; 41 1.5,-8; 42 2,-8; 43 2.5,-8; 44 3,-8; 45 3.5,-8; 46 4,-8; 47 4.5,-8; 48 5,-8; 49 5.5,-8; 50 6,-8; 76 6,8; 77 5.5,8; 78 5,8; 79 4.5,8; 80 4,8; 81 3.5,8; 82 3,8; 83 2.5,8; 84 2,8; 85 1.5,8; 86 1,8; 87 0.5,8; 88 0,8; 89 -0.5,8; 90 -1,8; 91 -1.5,8; 92 -2,8; 93 -2.5,8; 94 -3,8; 95 -3.5,8; 96 -4,8; 97 -4.5,8; 98 -5,8; 99 -5.5,8; 100 -6,8
QFN48 = smd 0.75 x 0.3: 1 -3.5,2.75; 2 -3.5,2.25; 3 -3.5,1.75; 4 -3.5,1.25; 5 -3.5,0.75; 6 -3.5,0.25; 7 -3.5,-0.25; 8 -3.5,-0.75; 9 -3.5,-1.25; 10 -3.5,-1.75; 11 -3.5,-2.25; 12 -3.5,-2.75; 25 3.5,-2.75; 26 3.5,-2.25; 27 3.5,-1.75; 28 3.5,-1.25; 29 3.5,-0.75; 30 3.5,-0.25; 31 3.5,0.25; 32 3.5,0.75; 33 3.5,1.25; 34 3.5,1.75; 35 3.5,2.25; 36 3.5,2.75; EP 0,0 | smd 0.3 x 0.75: 13 -2.75,-3.5; 14 -2.25,-3.5; 15 -1.75,-3.5; 16 -1.25,-3.5; 17 -0.75,-3.5; 18 -0.25,-3.5; 19 0.25,-3.5; 20 0.75,-3.5; 21 1.25,-3.5; 22 1.75,-3.5; 23 2.25,-3.5; 24 2.75,-3.5; 37 2.75,3.5; 38 2.25,3.5; 39 1.75,3.5; 40 1.25,3.5; 41 0.75,3.5; 42 0.25,3.5; 43 -0.25,3.5; 44 -0.75,3.5; 45 -1.25,3.5; 46 -1.75,3.5; 47 -2.25,3.5; 48 -2.75,3.5
QFN40 = smd 0.75 x 0.3: 1 -3,2.25; 2 -3,1.75; 3 -3,1.25; 4 -3,0.75; 5 -3,0.25; 6 -3,-0.25; 7 -3,-0.75; 8 -3,-1.25; 9 -3,-1.75; 10 -3,-2.25; 21 3,-2.25; 22 3,-1.75; 23 3,-1.25; 24 3,-0.75; 25 3,-0.25; 26 3,0.25; 27 3,0.75; 28 3,1.25; 29 3,1.75; 30 3,2.25; EP 0,0 | smd 0.3 x 0.75: 11 -2.25,-3; 12 -1.75,-3; 13 -1.25,-3; 14 -0.75,-3; 15 -0.25,-3; 16 0.25,-3; 17 0.75,-3; 18 1.25,-3; 19 1.75,-3; 20 2.25,-3; 31 2.25,3; 32 1.75,3; 33 1.25,3; 34 0.75,3; 35 0.25,3; 36 -0.25,3; 37 -0.75,3; 38 -1.25,3; 39 -1.75,3; 40 -2.25,3
AKL-059-02 = drill 1 pad 2: 1 -1.75,0; 2 1.75,0
HEADER_10_1.27 = drill 0.6: 1 -1.27,0; 2 -1.27,1.27; 3 0,0; 4 0,1.27; 5 1.27,0; 6 1.27,1.27; 7 2.54,0; 8 2.54,1.27; 9 3.81,0; 10 3.81,1.27
CHIPLED_0603 = smd 0.8 x 0.8: A 0,-0.75; C 0,0.75
MA20-2 = drill 1.016 octagon: 1 -24.13,-1.27; 2 -24.13,1.27; 3 -21.59,-1.27; 4 -21.59,1.27; 5 -19.05,-1.27; 6 -19.05,1.27; 7 -16.51,-1.27; 8 -16.51,1.27; 9 -13.97,-1.27; 10 -13.97,1.27; 11 -11.43,-1.27; 12 -11.43,1.27; 13 -8.89,-1.27; 14 -8.89,1.27; 15 -6.35,-1.27; 16 -6.35,1.27; 17 -3.81,-1.27; 18 -3.81,1.27; 19 -1.27,-1.27; 20 -1.27,1.27; 21 1.27,-1.27; 22 1.27,1.27; 23 3.81,-1.27; 24 3.81,1.27; 25 6.35,-1.27; 26 6.35,1.27; 27 8.89,-1.27; 28 8.89,1.27; 29 11.43,-1.27; 30 11.43,1.27; 31 13.97,-1.27; 32 13.97,1.27; 33 16.51,-1.27; 34 16.51,1.27; 35 19.05,-1.27; 36 19.05,1.27; 37 21.59,-1.27; 38 21.59,1.27; 39 24.13,-1.27; 40 24.13,1.27
TASTER_SMD_ALPS = smd 2 x 1.3: 1 -3.75,2.3; 2 -3.75,-2.3; 3 3.75,-2.3; 4 3.75,2.3
TP-2-MM = smd 2 x 2: P$1 0,0
TP-1-MM = smd 1 x 1: 1 0,0
XTAL_3.2X5 = smd 1 x 0.6: 1 -1.85,-1.1 | smd 2 x 1.2: 2 1.85,-1.1; 3 1.85,1.1; 4 -1.85,1.1
SMA_LP_1.57MM = smd 4.5 x 1.5: GND 7,2.45; GND@2 7,-2.45; PIN 7,0.1 | smd 4.5 x 1.5 bottom: GND@1 7,-2.45; GND@3 7,2.45
XTAL_3.2X2.5 = smd 0.5 x 0.5: 1 -1.15,-0.9 | smd 1.3 x 1.05: 2 1.15,-0.9; 3 1.15,0.9; 4 -1.15,0.9
1503_02 = smd 2.5 x 1.5: 1 -3.75,-10.75; 3 3.75,-10.75 | smd 2.5 x 2: 2 -3.75,-1.9; 2@2 3.75,-1.9 | hole 1: -2.5,-7; 2.5,-7

### Placement (x,y rotation side)
C1  11.3,35.3 270 top
C2  64.7,26.5 270 top
C3  65.3,44.2 270 top
C4  12.6,35.3 270 top
C5  66,26.5 270 top
C6  64,44.2 270 top
C7  16.1,33 180 top
C8  69.2,23.8 180 top
C9  68.4,41.8 180 top
C10  21.3,40.2 0 top
C11  18.4,35.3 270 top
C12  72,26.5 270 top
C13  71.4,43.9 270 top
C14  19.7,35.3 270 top
C15  73.3,26.5 270 top
C16  72.7,43.9 270 top
C17  31.5,15.96 135 top
C18  29.6,15.64 135 top
C19  34.1,10.3 180 top
C20  36.34,13.12 225 top
C21  37.3,12.12 225 top
C22  53.3,21.2 315 top
C23  29.7,28.7 135 top
C24  44.6,37.7 45 top
C25  54.2,22.1 315 top
C26  46.1,13.9 315 top
C27  36.3,15.6 225 top
C28  46.2,36.2 45 top
C29  33.9,18.1 225 top
C30  31.81,20.01 225 top
C31  93.8,36.6 180 top
C32  91.9,37.5 180 top
C33  90.4,40.7 270 top
C34  88.2,42.3 180 top
C35  88.2,41 180 top
C36  88.2,39.7 180 top
C37  84.8,40.1 0 top
C38  81.8,41.6 90 top
C39  79.1,46.9 90 top
C40  76.5,46.9 90 top
C41  84.4,41 0 top
C42  83,27.8 270 top
C43  80.4,27.8 270 top
C44  81.7,27.8 270 top
C45  77.6,28.2 180 top
C46  77.6,29.5 180 top
C47  77.6,30.8 180 top
C48  76.6,34.7 180 top
C49  77.6,33.4 180 top
C50  77.6,32.1 180 top
C51  83.6,11.6 270 top
C52  88.5,9.9 0 top
C53  85,13.3 90 top
C54  88.6,22.1 0 top
C55  85.9,21.2 270 top
C56  84.6,21.2 270 top
C57  74.9,17.7 180 top
C58  78.6,22.7 270 top
C59  86.4,17.2 0 top
C60  79.9,22.7 270 top
C61  86.3,13.3 270 top
C62  74.5,19.4 180 top
C63  79.6,9.7 270 top
C64  81.8,9.7 270 top
C65  27.7,23.6 0 top
C66  72.5,6.6 270 top
C67  59.5,8.3 0 top
C68  59.6,15.8 0 top
CON1  1.7,27.2 270 top
D1  94.5,38 270 top
F1  11,39.4 0 top
H1  95,45 0 top
H2  95,5 0 top
H3  5,45 0 top
H4  5,5 0 top
IC1  15.5,35.3 270 top
IC2  69.1,26.4 270 top
IC3  68.4,44.2 270 top
IC4  42,25 45 top
IC5  84.5,34.3 180 top
IC6  80.2,16.7 90 top
J1  4,36 270 top
J2  60.7,36.3 0 top
J3  78.1,4 0 top
J4  85.1,4 0 top
L1  17.1,40.2 0 top
L2  34.1,9 0 top
L3  91.9,36.6 180 top
L4  89.8,37.5 0 top
L5  89.8,36.6 0 top
LED1  2.7,16.2 0 top
LED2  4.2,16.2 0 top
LED3  5.8,16.2 0 top
LED4  7.4,16.2 0 top
R1  41.6,39.3 180 top
R2  10.7,28.25 0 top
R3  10.7,26.8 0 top
R4  32.1,30.7 135 top
R5  43.7,9.3 0 top
R6  88.5,8.5 180 top
R7  88.6,23.5 180 top
R8  27.7,22.2 180 top
R9  72.5,3.7 90 top
R10  59.5,9.7 0 top
R11  59.6,14.3 0 top
R12  2.7,13.3 90 top
R13  4.2,13.3 90 top
R14  5.8,13.3 90 top
R15  7.4,13.3 90 top
SV1  35,4 0 top
SV2  35,46 180 top
SW1  22.4,25.9 270 top
SW2  66,5 180 top
SW3  66,12 180 top
SW4  66,19 180 top
TP1  76.5,44 0 top
TP2  79.1,44 0 top
TP3  88.3,28 0 top
TP4  91.6,28 0 top
X2  27.77,13.71 135 top
X3  104.3,36.2 180 top
X4  84.8,43.5 90 top
X5  100,16 270 top

### Tracks (layer width: path | path; a pad name or v marks a point on that pad's centre or on a via)
+1V8  (via drill 0.5)
  Top 0.254: C47.1 79.61,32.05 IC5.35 | C43.1 C44.1 | C44.1 C42.1 | IC5.37 81.7,30.75 C44.1 | IC5.12 88,37.6 88.9,38.5 88.9,39.64 | 88.9,39.64 88.9,42.24 | 88.9,42.24 C34.1 | C33.1 89.42,41.46 C35.1 88.96,42.18 88.9,42.24 | C36.1 88.9,39.64
  Top 0.406: v80,31.4 79.9,31.4 v79.3,30.8 78.36,29.86 C46.1 | v80.7,29.7 80.4,29.4 C43.1 | v82.5,29.7 83,29.2 C42.1
  Top 0.61: C45.1 C46.1 C47.1
  other vias: 69.7,46.2 70.6,46.2 71.5,46.2 72.4,45.9 90.1,42.7 89,43.5 88.1,43.5
  pour Top (isolate 0.2): 68.7,44.3 68.7,46 69.4,46.7 72.1,46.7 73.4,45.4 73.4,44.5 73.3,44.4 71.6,44.4 71.5,44.3
  pour Route15 (isolate 0.2): 69.3,46.8 72.4,46.8 74.4,44.8 74.4,43.8 76.9,41.3 83.1,41.3 85.7,44.1 89.7,44.1 91.2,42.3 91.2,39.7 90,38.5 88.1,38.5 87,37.4 82.4,37.4 81.2,36.2 81.2,31.1 82.6,29.7 83.4,29.7 84.9,28.2 84.9,26.7 83.8,25.6 80.2,25.6 75.5,30.1 75.5,36.6 72.6,39.5 70.8,39.5 68.8,41.5 68.8,46.3
  pour Top (isolate 0.2): 87.9,44.2 89.6,44.2 91,42.8 91,40.8 90.9,40.7 88.5,40.7 88.2,41 88.2,42.7 88,42.9 87.4,43.5 87.4,43.7
+2V5  (via drill 0.5)
  Top 0.254: 75.6,17.7 75.65,17.65 | 75.65,17.65 75.85,17.45 IC6.34 | C59.1 85.29,16.95 | 85.29,16.95 IC6.16 | C61.1 86.3,14.5 v85.8,15 85.35,15.45 IC6.13 | 85.29,16.95 85.29,17.29 v86.3,18.3 | v72.8,18.5 74.86,18.5 C57.1 75.66,17.66 75.65,17.65
  Route15 0.254: v86.3,18.3 85.6,18.3 85.3,18.6 | v85.8,15 85.8,15.9 85.7,16
  other vias: 71.1,28.4 72,28.4 72.9,28.4
  pour Route15 (isolate 0.2): 69.1,28 69.1,26.4 69,19.8 74.9,14.5 77.2,12.2 84.3,12.2 86.3,14.2 86.3,20.2 83.8,22.7 78.7,22.7 75,26.4 75,27.6 73.6,28.8 69.8,28.8
  pour Top (isolate 0.2): 69.7,26.4 69.7,28.1 70.4,28.8 73.1,28.8 74.4,27.5 74.4,26.6 74.3,26.5 72.6,26.5 72.5,26.4
+3V3  (via drill 0.3, 0.5)
  Top 0.152: C30.1 32.64,20.59 IC4.6 | C29.1 34.52,18.94 IC4.11 | C27.1 37.34,16.1 IC4.19 | IC4.28 45.49,14.44 C26.1 | IC4.100 31.99,26.41 30.33,28.07 C23.1 | L2.1 33.04,8.7 v32,8.7 | IC6.33 77.15,18 77,18 | R5.2 44.76,9.1 v45.5,9.1
  Top 0.254: C48.1 C49.1 | C50.1 78.81,32.55 IC5.34 | 77.15,18 76.7,18 76.5,18.2 76.46,18.2 C62.1 75.26,20.04 | 30.33,28.07 30.17,28.07 v29.3,27.2 | IC4.6 33.87,21.87 v35,23 | IC4.11 36.6,21.01 v36.6,21.5 | IC4.19 38.52,17.22 39.4,18.1 40.3,18.1 v41.6,16.8 43.13,16.8 IC4.28 | 52.85,22.64 53,22.79 v53,23.8 | IC4.50 52.85,22.64 | 52.85,22.64 C25.1 | C24.1 43.41,36.51 IC4.75 42.5,34 42.5,33.1 v42.9,32.7 | R8.2 v26,22.2
  Top 0.406: 15.95,38.25 v15.7,38 | C49.1 C50.1 | C48.1 77.36,34.84 76.5,35.7 71,35.7 69.4,34.1 60.6,34.1 59.7,35 59.7,36.03 J2.1
  Top 0.61: 75.26,20.04 v74.8,20.5 | SV2.35 SV2.36 16.27,44.73 | 21,36.8 v20.7,37.1
  Route15 0.152: v45.5,9.1 45.9,9.4 45.9,9.9
  Route15 0.254: v41.6,16.8 41.1,16.8 40.8,17.1 | v42.9,32.7 42.9,32.6 42.6,32.3 | v26,22.2 26,22.3 25.7,22.6
  Route15 0.61: v55.4,17.8 54.6,17.5 54.6,17.4
  Route15 0.813: SV1.37 SV1.38 52.86,9 v45.5,9.1 | v15.7,38 16.07,38.47 16.07,44.73 SV2.36
  Bottom 0.61: v55.4,17.8 62.7,17.8 65.9,21 74.3,21 v74.8,20.5
  other vias: 16.7,38 17.7,38 18.7,38 19.7,38 20.7,38 19.7,37.1
  pour Top (isolate 0.2): 15.1,37.7 16,36.9 16,35.9 16.2,35.7 21,35.7 21.8,36.4 21.8,37.7 20.8,38.7 15.4,38.7 15.1,38.5
  pour Route15 (isolate 0.2): 14.8,39.1 60.1,39.1 60.1,30.6 55.9,25.8 55.9,13.6 49.7,7.4 29.2,7.4 23.4,13.2 23.4,31.6 19,36 17.4,36 14.8,37.2
+5V  (via drill 0.5)
  Top 0.152: IC2.3 68.65,25.45 69.1,25.9 69.1,27 68.8,27.3 68,27.3 IC2.1 | IC3.3 67.95,43.25 68.3,43.6 68.3,44.6 67.8,45.1 67.3,45.1 IC3.1 | R1.2 v39.3,39.3 | v81.8,11.6 C64.1 | 79.4,10.66 C63.1 79.5,10.56 v79.4,11.4
  Top 0.254: IC1.3 14.4,34.4 15.3,34.4 15.5,34.6 15.5,35.9 15.15,36.25 IC1.1 | IC6.5 79.95,10.81 C63.1 | IC6.8 81.45,10.81 C64.1 | R12.1 1.54,12.54 v1.5,12.5
  Top 0.61: IC2.1 67.86,27.26 C5.1 C2.1 | C6.1 C3.1 65.49,45.15 IC3.1 | 11.1,36.26 C1.1 11.3,41.1 12.3,42.1 17.5,42.1 18.05,41.55 L1.2 C10.1
  Top 0.813: C4.1 12.79,36.25 IC1.1 | SV2.34 18.49,40.64 L1.2 | SV2.33 18.52,47.3 21.1,47.3 21,47.2 21,44.7 18.4,44.7
  Top 1.016: C1.1 C4.1
  Route15 0.152: v39.3,39.3 38.3,40.3 38.3,41.6 38.1,41.8 21.2,41.8 | v79.4,11.4 79.6,11.2 C63.1
  Route15 0.254: v79.4,11.4 79.4,10.66 C63.1 79.86,10.2 79.9,10.2 | 61.9,27.8 62.3,27.8 62.6,27.5
  Route15 0.61: v81.8,11.6 81.8,10.6 81.3,10.1 79.96,10.1 C63.1
  Route15 0.813: 20.96,41.8 18.49,44.27 SV2.34
  Route15 1.016: SV2.34 SV2.32 SV2.31 SV2.33 | 20.96,41.8 21.2,41.8 59.4,41.8 | 59.4,41.8 62.8,45.2 | 61.8,27.9 61.9,27.8 | 61.8,27.9 61.8,22.5 68.1,16.2 68.1,11 69.8,9.3 79,9.3 79.9,10.2 81.5,10.2 | 59.4,41.8 60.2,41.8 62.5,39.5 65.5,39.5 67.9,37.1 67.9,34 61.8,27.9
  Bottom 0.254: SV2.34 16.66,42.9 10.5,42.9 7.5,39.9 3.1,39.9 1.5,38.3 1.5,33.7 3.2,32 3.2,14.2 v1.5,12.5
  other vias: 62,46.3 62.9,46.3 63.8,46.3 64.7,46.3 65.6,46.3 62,45.3 62.6,28.4 63.6,28.4 64.6,28.4 63.6,27.5 18.5,42.1 19.5,42.1 18.5,43.1 19.5,43.1 20.5,43.1 21.5,43.1
  pour Route15 (isolate 0.2): 61.7,46.9 66.9,46.9 68.1,45.7 68.1,43.8 68,43.7 62.1,43.7 61.2,44.6 61.2,46.4
  pour Route15 (isolate 0.2): 61.7,46.9 66.9,46.9 68.1,45.7 68.1,43.8 68,43.7 62.1,43.7 61.2,44.6 61.2,46.4
  pour Top (isolate 0.2): 61.7,46.9 66.9,46.9 68.1,45.7 68.1,44.3 62.1,44.3 61.2,44.6 61.2,46.4
  pour Top (isolate 0.2): 62.7,29.2 67.9,29.2 68.9,28.4 68.9,26.8 68.8,26.7 62.9,26.7 62,27.6 62,28.5
  pour Route15 (isolate 0.2): 62.7,29.2 67.9,29.2 67.9,26.7 62.9,26.7 62,27.6 62,28.5
  pour Top (isolate 0.2): 17.8,39.7 20.7,39.7 21.2,40.2 21.2,41.2 21.8,41.8 21.8,47.7 21.3,48.2 18.2,48.2 17.6,47.6 17.6,39.9
  pour Route15 (isolate 0.2): 17.8,39.7 20.7,39.7 21.2,40.2 21.2,41.2 21.8,41.8 21.8,47.7 21.3,48.2 18.2,48.2 17.6,47.6 17.6,39.9
CS43L22_RESET  (via drill 0.3)
  Top 0.152: v69.8,11.4 70.2,11.4 71.3,12.5 71.3,13.3 72.4,14.4 72.4,17.7 71.8,18.3 71.8,20 73,21.2 75.4,21.2 76.1,20.5 76.1,19.2 76.85,18.45 IC6.32 | v38.9,30.3 38.82,30.3 IC4.85
  Bottom 0.152: v69.8,11.4 69.6,11.6 50.5,11.6 49.3,10.4 44.4,10.4 42.5,12.3 42.2,12.3 39.5,15 39.5,18 42.3,20.8 42.3,27.4 40.6,29.1 40.1,29.1 v38.9,30.3
GND  (via drill 0.3, 0.3 pad 0.3, 0.5, 0.5 pad 0.3)
  Top 0.152: IC4.99 31.3,27.92 31.3,28.5 30.2,29.6 29.6,29.6 29.24,29.24 C23.2 v28.3,30.1 | v28.3,30.1 | C41.1 83.9,41.05 | IC6.35 77.15,16.9 v73.2,16.9 | C62.2 73.54,19.6 v72.7,19.6 | 82.7,34.4 IC5.EP | C37.1 83.7,40.1 v82.9,40.9
  Top 0.254: C19.2 32.8,10.3 v32,9.5 | R6.1 v90.6,8.5 | SW1.2 18.85,29.65 v18.7,29.8 | C30.2 30.77,19.47 v30.3,19 | SW1.3 19.65,21.7 v18.7,21.7 | v26,24 26.54,24 C65.1 | C57.2 73.34,16.9 v73.2,16.9 | IC6.17 84.45,17.45 85.6,18.6 85.6,18.7 86,19.1 86.9,19.1 v87.2,19.4 | C61.2 86.2,12.44 v86.2,11.5 85.34,10.64 C51.2 | C59.2 87.16,19.36 v87.2,19.4 | C56.1 C55.1 86.34,21.96 86.8,21.5 86.8,19.8 v87.2,19.4 | R7.1 94.35,23.5 X5.2 | IC6.3 78.95,12.85 v77.9,11.7 | C58.1 C60.1 79.84,23.4 77.8,23.4 76.8,22.4 v76.8,19.9 76.8,19.35 IC6.31 | IC5.39 IC5.40 IC5.41 IC5.42 84.1,30.65 v84.1,29.7 | IC5.47 86.7,30.75 v86.7,29.7 | IC5.5 IC5.6 | IC5.6 IC5.7 IC5.8 IC5.9 | IC5.6 88.45,34.5 v89.5,35.3 | L4.1 89.3,37.55 89.3,38.1 v89.8,38.6 91.9,38.6 92.4,38.1 92.4,37.55 C32.1 | D1.A 93.95,39 v93.6,39 | C33.2 90.44,39.9 v91.7,39.9 | X4.2 85.75,44.7 v86.9,44.7 | C40.2 77.78,47.66 | 77.78,47.66 C39.2 | 77.78,47.66 77.8,47.68 v77.8,48.4 | C68.1 v57.6,15.8 | SW3.2 SW3.3 63,14.3 64.9,16.2 64.9,16.45 SW4.2 | SW2.2 69.2,7.3 | 69.2,7.3 SW2.3 61.16,7.3 SV1.40 58.74,5.66 C67.1 | SW4.3 SW4.2 | SW4.2 69.75,22.65 v69.8,22.7 | C25.2 C22.2 54.04,20.66 v54.9,19.8 | C63.2 79.6,7.8 v79.5,7.7 | C64.2 81.8,7.8 v81.9,7.7 | C28.2 46.74,37.64 v47.5,38.4 | R4.2 31.56,31.46 v32.4,32.3 | IC4.10 34.48,19.6 34.3,19.6 33.36,18.66 C29.2 33.06,17.76 v32.4,17.1 31.8,16.5 C17.2 29.38,16.5 C18.2 | IC4.20 37.01,15.06 C27.2 35.3,14.6 35.3,13.1 34.9,12.7 34.9,12.2 v34.6,11.9 35.12,11.9 C20.2 36.76,11.62 C21.2 | IC4.27 43.77,15.43 44.5,14.7 44.5,14.2 v45.7,13 46.28,13 C26.2 | IC4.74 43.85,34.55 44.6,35.3 44.6,35.9 44.9,36.2 44.9,36.23 46.04,37.38 | IC3.2 66.7,44.2 65.94,43.44 C3.2
  Top 0.254: C66.1 69.26,7.36 69.2,7.3 | IC2.2 67.5,26.4 66.9,25.8 66.06,25.8 C5.2 | IC6.EP v80.2,15.8 v79.3,15.8 | IC5.EP 82.8,34.3 82.7,34.4 | v97.4,33.7 v96.5,33.7 97.25,33.7 X3.GND 95.65,33.75 v95.6,33.7 | X3.GND@2 96.75,38.65 v96.7,38.6 98.5,38.6 98.45,38.65 X3.GND@2 | X3.GND@2 95.85,38.65 v95.8,38.6 | LED4.C LED3.C LED2.C LED1.C 1.75,16.95 1.3,17.4 1.3,19.9 3.2,21.8 v4,21.8 | v82.9,40.9 83.85,40.9 C41.1 | C38.2 82.44,42.36 82.9,41.9 v82.9,40.9 | X4.4 83.9,41.9 v82.9,40.9
  Top 0.406: X2.2 28,16.56 v28,16.8 | X2.4 28.83,11.1 v30.2,11.1
  Top 0.61: 20.3,33.1 v20,33.4 | C10.2 22.25,38.95 v22.8,38.4
  Top 1.016: C24.2 46.04,37.38 C28.2
  Route2 0.152: v72.7,19.6 72.2,20.1 71.8,20.1
  Route2 0.254: v90.6,8.5 91,8.9 91,9.1 | v26,24 25.7,24.7 | v73.2,16.9 72.9,17.2 72.5,17.2 | v86.2,11.5 85.8,11.1 | v84.1,29.7 84.4,29.4 84.6,29.4 | v86.7,29.7 86.2,29.6 | v89.5,35.3 89.5,34.8 | v89.8,38.6 90.3,39 90,39 | v93.6,39 93.3,39.3 92.7,39.3 | v91.7,39.9 92,40.2 92,40.4 | v82.9,40.9 81.9,44.2 81.7,44.2 | v86.9,44.7 87.4,45.2 | v77.8,48.4 77.5,48.7 77,48.7 | v57.6,15.8 57.6,16 56.8,16.8 | v54.9,19.8 56.3,19.8 | 79,7.7 v79.5,7.7 v81.9,7.7 | v45.7,13 45.8,13 46.1,12.7 46.1,12.82 C26.2
  Route2 0.61: v22.8,38.4 22.8,38 22.6,37.8
  Bottom 0.152: v84.5,35.4 82.7,34.4
  Bottom 0.254: X3.GND@2 95.85,38.65 v95.8,38.6 | X3.GND 95.65,33.75 v95.6,33.7
  other vias: 5.8,25.3 5.8,24.4 6.7,25.3 6.7,24.4 5.8,23.5 6.7,22.6 5.8,22.6 6.7,23.5 11.2,33.4 12.1,33.4 13,33.4 13.9,33.4 9.9,34.8 12.1,32.5 13,32.5 13.9,32.5 18,33.4 19,33.4 18,32.5 19,32.5 96.2,19.4 96.2,20.3 96.2,21.2 98.1,21.7 97.2,21.7 81.1,17.6 79.3,17.6 80.2,17.6 80.2,16.7 81.1,16.7 79.3,16.7 65.3,22.7 67.1,22.7 66.2,22.7 68,22.7 68.9,22.7 70.7,22.7 71.6,22.7 71.6,23.7 67.1,23.7 72.5,22.7 72.5,23.7 63.1,42.1 64.1,42.1 65.1,42.1 66.1,42.1 66.1,41.1 65.1,41.1 64.1,41.1 70.6,41.9 71.5,41.9 72.4,41.9 72.4,41 71.5,41 70.6,41 83.5,35.4 85.5,35.4 83.5,34.3 85.5,34.3 84.5,33.2 83.5,33.2 84.5,34.3 97.6,38.6 93.6,35.5 92.6,35.5 91.6,35.5 90.6,35.5 93.5,37.8 90.8,38.6 91.8,38.6 92.8,38.6 1,25.4 1.8,25.4 4.9,22.6 4,22.6 4.9,21.8 5.8,21.8 6.7,21.8 85.5,33.2 81.1,15.8
  pour Route2 (isolate 0.2, rank 3): 0,0 100,0 100,50 0,50
  pour Top (isolate 0.2): 8.5,34.6 11,32.1 19.4,32.1 20.2,32.9 20.8,32.9 21.3,33.4 21.3,34.8 20.8,35.3 16,35.3 15.6,35.7 15.6,36.7 14.7,37.6 9.7,37.6 8.5,36.4
  pour Top (isolate 0.2): 98.1,18.5 96.5,18.5 95.7,19.3 95.7,21.7 96.1,22.1 98.4,22.1 99,21.5 99,19.4
  pour Top (isolate 0.2): 62.7,23.8 64.3,22.2 72.9,22.2 74.2,23.2 74.2,25.3 74.1,25.9 69.4,25.9 69.2,26.3 63.4,26.3 62.7,25.6
  pour Top (isolate 0.2): 62.2,41.4 63.8,39.8 72.4,39.8 73.7,40.8 73.7,42.9 73.5,43.8 67.7,43.8 63,43.9 62.2,43.2
  pour Top (isolate 0.2): 99.5,33 87.9,33 87.3,33.6 87.3,37.5 88.2,38.4 88.8,39 92,39 92.8,39.8 99.5,39.8
  pour Top (isolate 0.2): 0.9,26.2 6.5,26.2 7.6,25.1 7.6,21.5 6.6,20.5 1,20.5 0.3,21.2 0.3,25.6
  pour Bottom (isolate 0.2): 80.4,37.6 82.2,39.4 85.8,39.4 87.7,37.5 87.7,37.2 87.7,31.9 86.6,30.8 82.1,30.8 80.5,32.4 80.2,32.7 80.2,37.4
  pour Bottom (isolate 0.2): 76.3,18.4 78.2,20.8 82.1,20.8 84.2,18.6 84.2,14.3 82.6,12.7 77.8,12.7 76.3,14.2
I2C1_SCL  (via drill 0.3)
  Top 0.152: IC6.2 78.45,13.05 77.8,12.4 74.7,12.4 v74.1,11.8 | v37.9,28.1 36.07,28.1 IC4.92
  Bottom 0.152: v74.1,11.8 73.8,11.8 73.4,11.4 71.3,11.4 70.7,10.8 68.8,10.8 68.5,11.1 50.9,11.1 49.8,10 44.1,10 42.4,11.7 42,11.7 39.1,14.6 39.1,18.4 41.7,21 41.7,26.8 40.4,28.1 v37.9,28.1
I2C1_SDA  (via drill 0.3)
  Top 0.152: IC6.1 76.9,13.7 v76.4,13.2 | v34.6,26.1 34.6,26.74 IC4.96
  Bottom 0.152: v76.4,13.2 76.4,13 74.4,11 71.7,11 71.1,10.4 68.6,10.4 68.4,10.6 51.4,10.6 50.3,9.5 50.3,9.4 49,8.1 45.2,8.1 42.3,11 41.9,11 38.5,14.4 38.5,18.9 39.6,20 39.6,20.9 34.6,25.9 v34.6,26.1
I2S2_CK  (via drill 0.3)
  Top 0.152: 80.65,36.05 IC5.27 80.55,36.05 79.2,37.4 79.2,37.7 78.4,38.5 v77.5,38.5 | v49.3,24 50.77,22.52 IC4.47
  Bottom 0.152: v77.5,38.5 76.3,38.5 62.1,24.4 55.7,24.4 54.9,25.2 50.5,25.2 v49.3,24
I2S2_SD  (via drill 0.3)
  Top 0.152: IC5.33 79.75,33.05 v79.6,33.2 | IC4.18 38.11,17.61 39.7,19.2 43,19.2 v43.5,18.7
  Bottom 0.152: v79.6,33.2 79.5,33.1 74.7,33.1 63,21.4 57.7,21.4 57,20.7 53.2,20.7 48.8,16.3 48.8,14.7 47.7,13.6 46.5,13.6 46.1,14 45.4,14 43.5,15.9 v43.5,18.7
I2S2_WS  (via drill 0.3)
  Top 0.152: IC5.28 80.55,35.55 78.3,37.8 v78.2,37.8 | IC4.51 53.69,26.41 54.5,25.6 v54.5,24.6
  Bottom 0.152: v78.2,37.8 76.3,37.8 62.1,23.6 55.1,23.6 54.5,24.2 v54.5,24.6
I2S3_CK  (via drill 0.3)
  Top 0.152: IC6.38 73.85,15.45 73.3,14.9 73.3,13.1 v73.1,12.9 | v40.8,31.8 40.8,33.27 IC4.78
  Bottom 0.152: v73.1,12.9 72.5,12.3 71.1,12.3 70.9,12.5 49.8,12.5 48.5,11.2 45.1,11.2 42.7,13.6 42.3,13.6 40.3,15.6 40.3,17.3 43.5,20.5 43.5,25.5 43.4,25.6 43.4,27.9 41.2,30.1 41.2,31.4 v40.8,31.8
I2S3_MCK  (via drill 0.3)
  Top 0.152: IC6.37 73.45,15.95 72.8,15.3 72.8,13.9 v71.9,13 | v44.1,26.5 44.1,27.81 IC4.64
  Bottom 0.152: v44.1,26.5 44.1,20.2 40.8,16.9 40.8,15.8 42.6,14 43,14 45.4,11.6 47.9,11.6 49.4,13.1 71.8,13.1 v71.9,13
I2S3_SD  (via drill 0.3)
  Top 0.152: IC6.39 75.45,14.95 v75,14.5 | v40.5,30 40.1,30.4 40.1,32.56 IC4.80
  Bottom 0.152: v75,14.5 75,14 72.9,11.9 70.9,11.9 70.8,12 50.1,12 48.9,10.8 44.7,10.8 42.6,12.9 42.3,12.9 39.9,15.3 39.9,17.6 42.8,20.5 42.8,27.7 v40.5,30
I2S3_WS  (via drill 0.3)
  Top 0.152: IC6.40 75.95,14.45 75.2,13.7 v73.9,13.7 | v42.7,17.8 42.84,17.8 IC4.29
  Bottom 0.152: v73.9,13.7 72.6,13.7 72.5,13.6 48.9,13.6 47.4,12.1 45.7,12.1 42.7,15.1 v42.7,17.8
N$1
  Top 0.152: L3.1 C31.2
N$2
  Top 0.152: IC5.10 89.8,36.05 L5.2 L4.2 C32.2 L3.2
N$3
  Top 0.254: L5.1 89.2,36.55 IC5.11
N$4
  Top 0.254: IC5.13 87.44,37.99 C36.2 C35.2 C34.2
N$5
  Top 0.254: IC5.36 81,31.2 79.3,29.5 79.3,27.4 | 79.3,27.4 79.7,27 79.9,27 | 79.9,27 81.74,27 | C42.2 82.96,27 81.74,27 | 79.3,27.4 77.64,27.4 C45.2 C46.2 | C47.2 C50.2 | 81.74,27 C44.2 | C43.2 79.94,27.04 79.9,27
  Top 0.61: C48.2 C49.2 C50.2 | C47.2 C46.2
N$6
  Top 0.152: X4.1 85.7,40.45 C37.2 86.25,39.2 IC5.15
N$7
  Top 0.152: IC5.16 85.75,38.75 84.8,39.7 84.8,40.5 84.95,40.65 C41.2 84.8,41.15 84.8,43 83.9,43.9 X4.3
N$8
  Top 0.152: IC5.17 85.25,38.55 84.5,39.3 83.54,39.3 C38.1
N$9
  Top 0.61: C7.1 16.86,34.14 IC1.4
N$10
  Top 0.406: C8.1 69.96,25.16 IC2.4
N$11
  Top 0.61: C9.1 69.55,42.19 IC3.4
N$12
  Top 0.152: C20.1 36.88,14.22 IC4.21 | IC4.22 38,14.64 38,12.82 37.92,12.74 C21.1
  Top 0.254: L2.2 C19.1 37.1,10.3 38,11.2 38,12.49 C21.1 | 37.92,12.74 37.8,12.74 C20.1
N$13
  Top 0.152: C28.1 45.6,35.6 45.53,35.6 IC4.73
N$14
  Top 0.152: C22.1 52.76,22.02 IC4.49
N$15
  Top 0.254: CON1.3 9.54,27.2 R3.1
N$16
  Top 0.254: CON1.2 9.54,27.85 R2.1
N$19
  Top 0.152: IC4.13 35.7,18.7 35.7,18.3 33.1,15.7 33.1,15.4 31.9,14.2 31.04,14.2 C18.1 29.74,14.7 29.74,13.3 X2.1
N$20
  Top 0.152: IC4.12 35.3,19.01 35.3,18.4 32.32,15.42 C17.1 32.02,15.4 31,15.4 30.4,16 30,16 28.24,14.24 X2.3
N$21
  Top 0.152: R4.1 34.22,28.58 IC4.94
N$22
  Top 0.254: SW2.4 62.66,2.29 64.84,4.46 R9.2 C66.2
N$23
  Top 0.254: SW4.4 60.36,14.81 R11.2 C68.2
N$24
  Top 0.254: SW3.4 R10.2 C67.2
N$25
  cutout Route2 (isolate 0.2, rank 2): 100,23 74,23 74,27 100,27
N$26
  Top 0.254: R12.2 LED1.A
N$27
  Top 0.254: LED2.A R13.2
N$28
  Top 0.254: LED3.A R14.2
N$29
  Top 0.254: LED4.A R15.2
N$30
  Top 0.61: L1.1 14.25,40.2 F1.P$2
N$31
  Top 0.406: CON1.1 6.7,28.5 8.1,29.9 8.1,33.2 8.75,33.85 8.75,34.25
  Top 0.61: J1.2 8.75,34.25 8.75,39.2 F1.P$1
N$32
  Top 0.254: IC6.4 79.45,12.65 78.7,11.9 78.7,6.35 J3.1
N$33
  Top 0.254: IC6.6 80.45,4.6 J3.2
N$34
  Top 0.254: J4.1 80.95,6.4 IC6.7
N$64
  Top 0.254: IC6.9 81.95,12.95 82.7,12.2 82.7,8.15 J4.2
N$66
  Top 0.254: IC6.15 87.75,16.45 88.7,17.4 88.7,19.2 X5.1 89.25,21.99 C54.2
N$67
  Top 0.254: IC6.14 85.95,15.95 89.25,12.65 X5.3 89.25,9.91 C52.2
N$69
  Top 0.254: C52.1 R6.2
N$71
  Top 0.254: C54.1 R7.2
N$72
  Top 0.254: C56.2 84.6,19 84.05,18.45 IC6.19
N$73
  Top 0.254: IC6.18 84.25,17.95 85.2,18.9 85.2,19.6 85.9,20.3 C55.2
N$74
  Top 0.254: IC6.28 78.95,20.75 78.7,21 78.7,21.84 C58.2
N$75
  Top 0.254: IC6.27 79.45,20.75 79.8,21.1 79.8,21.84 C60.2
N$76
  Top 0.254: IC6.10 82.45,13.31 C51.1
N$77
  Top 0.254: IC6.11 83.35,14.45 83.35,14.19 C53.1
N$78
  Top 0.254: IC6.12 84.11,14.95 C53.2
NRST  (via drill 0.3)
  Top 0.152: IC4.14 37.8,20.09 v37.8,21
  Top 0.254: SW1.4 24.7,22 25.7,21 27.26,21 R8.1 C65.2 30.5,23.6 v30.9,24
  Bottom 0.152: J2.10 64.51,38.09 62.3,40.3 51.2,40.3 48.1,37.2 39.7,37.2 35.5,33 35.1,33 33.8,31.7 33.8,25
  Bottom 0.254: v30.9,24 32.8,24 33.8,25 34.4,25 37.8,21.6 v37.8,21
PA0
  Top 0.152: SV1.13 25.87,2.73 24.9,3.7 24.9,6.2 26.3,7.6 34.4,7.6 35.1,8.3 35.9,8.3 38.8,11.2 38.8,14.73 IC4.23
PA1
  Top 0.152: 26.27,5.27 SV1.14 27.94,7.1 34.5,7.1 35.3,7.9 36.2,7.9 39.2,10.9 39.2,14.42 IC4.24
PA2
  Top 0.152: SV1.15 28.37,2.73 27.4,3.7 27.4,5.8 28.3,6.7 34.6,6.7 35.4,7.5 36.4,7.5 39.6,10.7 39.6,14.12 IC4.25
PA3
  Top 0.152: SV1.16 29.58,6.3 34.7,6.3 35.5,7.1 36.6,7.1 40.1,10.6 40.1,13.5 40.4,13.8 42.1,13.8 IC4.26
PA8
  Top 0.152: IC4.67 46.37,32.07 47.8,33.5 48.4,33.5 50.3,35.4 50.3,39.6 48.6,41.3 46.4,41.3 44.6,43.1 43.6,43.1 42.7,44 42.7,45.92 SV2.15
PA9  (via drill 0.5)
  Top 0.152: IC4.68 46.02,32.42 47.5,33.9 48.1,33.9 49.8,35.6 49.8,39.4 48.4,40.8 46.2,40.8 44.4,42.6 43.48,42.6 SV2.16 | R1.1 39.6,42.06 v39.6,43
  Bottom 0.152: v39.6,43 41.33,44.73 SV2.16
PA10  (via drill 0.5)
  Top 0.152: IC4.69 45.68,32.78 47.2,34.3 47.8,34.3 49.3,35.8 49.3,39.1 48.1,40.3 46,40.3 44.3,42 42.1,42 40.1,44 40.1,45.98 SV2.17
  Top 0.254: CON1.4 4.45,26.6 7.2,26.6 v8.4,25.4
  Bottom 0.254: v8.4,25.4 14.1,31.1 20,31.1 31.6,42.7 36.9,42.7 37.5,43.3 37.5,45.96 SV2.17
PB0
  Top 0.152: IC4.35 46.6,18.2 47.3,17.5 47.5,17.5 49.2,15.8 49.2,13.7 46.9,11.4 42.8,11.4 37.6,6.2 37.6,3.9 38.77,2.73 SV1.23
PB1
  Top 0.152: IC4.36 50.1,15.49 50.1,13.3 47.25,10.45 47.2,10.4 42.5,10.4 38.81,6.71 SV1.24
PB2
  Top 0.152: IC4.37 50.5,15.79 50.5,13.1 45.8,8.4 42.3,8.4 | 42.3,8.4 41.1,8.4 40.1,7.4 40.1,3.98 SV1.25 | R5.1 42.94,9.04 42.3,8.4
PB4
  Top 0.152: SV2.26 28.65,44.65 31.1,42.2 33,42.2 34.2,41 34.2,31.3 35.45,30.05 IC4.90
PB5
  Top 0.152: IC4.91 33.8,31.08 33.8,40.8 32.8,41.8 29.7,41.8 27.4,44.1 27.4,45.98 SV2.27
PB11
  Top 0.152: IC4.48 51.22,22.88 51.9,22.2 51.9,21.6 54.5,19 54.5,11.1 52,8.6 52,7.2 53.93,5.27 SV1.36
  Top 0.254: R11.1 55.64,11.1 54.5,11.1
PB13
  Top 0.152: IC4.52 57.5,32.72 57.5,37.9 60.5,40.9 60.5,45.9 SV2.1
PB14
  Top 0.152: SV2.2 59.13,40.13 57.1,38.1 57.1,33 51.22,27.12 IC4.53
PB15
  Top 0.152: IC4.54 56.7,33.34 56.7,38.6 57.9,39.8 57.9,45.96 SV2.3
PC0
  Top 0.152: IC4.15 36.94,18.64 33.4,15.1 33.4,14.2 33.7,13.9 33.7,13.4 30.7,10.2 29.5,9 24.1,9 22.1,7 20.9,7 19.8,5.9 19.8,3.7 20.77,2.73 SV1.9
PC1
  Top 0.152: IC4.16 36.72,17.6 36.4,17.6 33.8,15 33.8,14.4 34.1,14.1 34.1,13.2 30.8,9.8 29.6,8.6 24.3,8.6 21.03,5.33 SV1.10
PC2
  Top 0.152: IC4.17 37.73,17.93 37,17.2 36.6,17.2 34.3,14.9 34.3,14.6 34.5,14.4 34.5,13 31,9.4 29.8,8.2 24.6,8.2 22.3,5.9 22.3,4 SV1.11
PC4
  Top 0.152: SV1.21 35,4 35,6 35.7,6.7 36.8,6.7 42.3,12.2 46.6,12.2 48.4,14 48.4,15.6 47.4,16.6 46.9,16.6 45.92,17.57 IC4.33
PC5
  Top 0.152: 36.27,5.97 SV1.22 36.27,5.57 42.5,11.8 46.7,11.8 48.8,13.9 48.8,15.7 47.5,17 47.1,17 46.24,17.86 IC4.34
PC6
  Top 0.152: SV2.12 46.43,44.17 47.8,42.8 49.2,42.8 51.7,40.3 51.7,34.7 IC4.63
PC8
  Top 0.152: IC4.65 46.96,31.36 48.2,32.6 48.9,32.6 51.3,35 51.3,40 49.1,42.2 47.1,42.2 45.2,44.1 45.2,45.96 SV2.13
PC9
  Top 0.152: SV2.14 43.89,44.61 46.7,41.8 48.8,41.8 50.8,39.8 50.8,35.2 48.7,33.1 47.98,33.1 IC4.66
PC11
  Top 0.152: SV2.18 37.4,43.32 37.4,35.96 IC4.79
PC13
  Top 0.152: IC4.7 34.16,21.46 33.3,20.6 33.3,20.4 31.2,18.3 22.9,18.3 17.3,12.7 14.4,12.7 12,10.3 12,8.2 12.8,7.4 13.82,7.4 SV1.6
PC14
  Top 0.152: IC4.8 34.58,21.07 31.4,17.9 23.1,17.9 17.5,12.3 14.7,12.3 12.5,10.1 12.5,8.3 13,7.8 14.3,7.8 15.2,6.9 16,6.9 17.2,5.7 17.2,3.7 18.17,2.73 SV1.7
PC15
  Top 0.152: IC4.9 34.86,20.76 31.6,17.5 23.3,17.5 17.6,11.8 14.9,11.8 13,9.9 13,8.5 13.2,8.3 14.4,8.3 15.4,7.3 16.46,7.3 SV1.8
PD0
  Top 0.152: IC4.81 37,34.95 37,43.6 37.5,44.1 37.5,46.2 36.43,47.27 SV2.19
PD1
  Top 0.152: SV2.20 36.6,44.4 36.6,34.64 IC4.82
PD2
  Top 0.152: IC4.83 36.2,34.34 36.2,42.7 35,43.9 35,46 SV2.21
PD3
  Top 0.152: IC4.84 35.8,34.03 35.8,42.3 33.73,44.37 SV2.22
PD5
  Top 0.152: IC4.86 35.4,33.01 35.4,41.7 33.7,43.4 33,43.4 32.6,43.8 32.6,45.6 31.19,47.01 SV2.23
PD6
  Top 0.152: SV2.24 31.19,44.71 32.9,43 33.4,43 35,41.4 35,32.71 IC4.87
PD7
  Top 0.152: SV2.25 29.9,46.02 29.9,44.1 31.4,42.6 33.2,42.6 34.6,41.2 34.6,32.5 35.8,31.3 35.8,31.2 IC4.88
PD8
  Top 0.152: SV2.4 56.59,39.19 56.3,38.9 56.3,33.64 IC4.55
PD9
  Top 0.152: IC4.56 55.3,33.35 55.3,46.02 SV2.5
PD10
  Top 0.152: IC4.57 54.8,33.56 54.8,43.98 SV2.6
PD11
  Top 0.152: IC4.58 54.3,33.76 54.3,42 52.8,43.5 52.8,45.98 SV2.7
PD12
  Top 0.152: SV2.8 51.51,44.09 53.8,41.8 53.8,33.97 IC4.59
PD13
  Top 0.152: IC4.60 53.3,34.18 53.3,41.1 50.2,44.2 50.2,46.04 SV2.9
PD14
  Top 0.152: SV2.10 52.8,40.9 52.8,34.39 IC4.61
PD15
  Top 0.152: IC4.62 52.2,34.49 52.2,40.5 49.5,43.2 48.2,43.2 47.7,43.7 47.7,46 SV2.11
PE0
  Top 0.152: SV2.28 26.17,44.73 29.5,41.4 32.6,41.4 33.4,40.6 33.4,35 30.5,32.1 30.5,31.1 32.1,29.5 32.1,28.54 IC4.97
PE1
  Top 0.152: SV2.29 24.9,45.94 24.9,44 27.9,41 32.4,41 33,40.4 33,35.2 30.1,32.3 30.1,30.8 31.7,29.2 31.7,28.2 32.78,27.12 IC4.98
PE2
  Top 0.152: SV1.1 10.57,2.73 9.4,3.9 9.4,9.3 | 9.4,9.3 9.4,10.7 13.4,14.7 16.2,14.7 22,20.5 28.5,20.5 31,23 31.5,23 32.09,23.59 IC4.1 | R13.1 4.2,11.9 6.5,9.6 9.1,9.6 9.4,9.3
PE3  (via drill 0.5)
  Top 0.152: SV1.2 9.9,6.24 9.9,10.6 13.6,14.3 16.4,14.3 22.2,20.1 28.7,20.1 31.2,22.6 31.82,22.6 IC4.2 32.33,23.23 | R14.1 5.8,12.3 7.1,11 v8.5,11
  Bottom 0.152: v8.5,11 10.87,8.63 SV1.2
PE4  (via drill 0.5)
  Top 0.152: SV1.3 13.07,2.73 12,3.8 12,6 10.4,7.6 10.4,10.5 13.8,13.9 16.6,13.9 22.4,19.7 28.9,19.7 31.4,22.2 32.1,22.2 32.78,22.88 IC4.3 | R15.1 7.54,12.4 v9,12.4
  Bottom 0.152: v9,12.4 12,9.4 12,4.14 SV1.3
PE5
  Top 0.152: 33.16,22.46 IC4.4 32.44,21.8 31.5,21.8 29,19.3 22.6,19.3 16.8,13.5 14,13.5 11,10.5 11,7.7 12.5,6.2 12.5,6.18 SV1.4
PE6
  Top 0.152: IC4.5 33.47,22.17 32.7,21.4 31.7,21.4 29.2,18.9 22.9,18.9 17.1,13.1 14.2,13.1 11.4,10.3 11.4,7.9 12.6,6.7 13.8,6.7 14.6,5.9 14.6,4.08 SV1.5
PE7
  Top 0.152: SV1.26 41.35,7.55 41.8,8 46,8 50.9,12.9 50.9,16.1 IC4.38
PE8
  Top 0.152: IC4.39 51.3,16.41 51.3,12.7 46.2,7.6 43.5,7.6 42.6,6.7 42.6,4.02 SV1.27
PE9
  Top 0.152: SV1.28 43.89,6.79 44.3,7.2 46.4,7.2 51.7,12.5 51.7,16.71 IC4.40
PE10
  Top 0.152: IC4.41 52.1,17.02 52.1,12.3 46.6,6.8 45.7,6.8 45.2,6.3 45.2,3.96 SV1.29
PE11
  Top 0.152: SV1.30 46.43,6.03 52.5,12.1 52.5,17.33 IC4.42
PE12
  Top 0.152: IC4.43 52.9,17.64 52.9,11.9 47.8,6.8 47.8,3.9 SV1.31
PE13
  Top 0.152: SV1.32 48.97,7.37 53.3,11.7 53.3,17.94 IC4.44
PE14
  Top 0.152: IC4.45 53.7,18.25 53.7,11.5 50.3,8.1 50.3,3.94 SV1.33
  Top 0.254: SV1.33 51.51,2.69 53,1.2 70.76,1.2 R9.1
PE15
  Top 0.152: SV1.34 51.51,8.71 54.1,11.3 54.1,18.5 50.48,22.11 IC4.46
  Top 0.254: R10.1 55.3,6.26 55.3,4.7 54.6,4 52.6,4 51.51,5.09 SV1.34
RF_IN
  Top 0.152: D1.K 94.45,36.6 C31.1 94.4,36.6 94.9,36.1 X3.PIN
SI4688_INTB  (via drill 0.3)
  Top 0.152: IC5.3 88.95,32.55 89.5,32 89.5,28.1 | 89.5,28.1 89.5,26.6 88.2,25.3 77.6,25.3 73.3,29.6 61.6,29.6 58.8,26.8 58.8,25.6 56.4,23.2 55.1,23.2 53,25.3 49.7,25.3 49.2,25.8 v40.8,25.8 | v36,27.5 35.96,27.5 IC4.93 | TP3.1 88.4,28.1 89.5,28.1
  Bottom 0.152: v40.8,25.8 37.7,25.8 v36,27.5
SI4688_LOUT
  Top 0.152: IC5.18 84.75,38.45 84.3,38.9 83.1,38.9 82.6,39.4 81.9,39.4 80.5,40.8 80.5,42.6 TP2.P$1 C39.1
SI4688_ROUT
  Top 0.152: IC5.19 84.25,38.25 84,38.5 83,38.5 82.5,39 81.7,39 76.7,44 TP1.P$1 C40.1
SI4688_RSTB  (via drill 0.3)
  Top 0.152: IC5.4 88.05,33.1 89.3,33.1 89.9,32.5 89.9,28.1 | 89.9,28.1 89.9,26.3 88.5,24.9 77.4,24.9 73.1,29.2 61.9,29.2 59.4,26.7 59.4,25.5 56.7,22.8 54.9,22.8 52.8,24.9 49.4,24.9 49,25.3 41.3,25.3 v40.8,24.8 | v35.4,26.7 35.35,26.7 IC4.95 | TP4.1 91.5,28.1 89.9,28.1
  Bottom 0.152: v40.8,24.8 37.3,24.8 v35.4,26.7
SPI1_MISO  (via drill 0.3)
  Top 0.152: IC5.32 80.05,33.55 v79.5,34.1 | IC4.31 45.18,16.82 46.3,15.7 46.7,15.7 47.1,15.3 v47.1,14.4
  Bottom 0.152: v79.5,34.1 75.1,34.1 62.8,21.8 57.4,21.8 56.7,21.1 52.9,21.1 48.4,16.6 48.4,14.9 48.1,14.6 47.3,14.6 v47.1,14.4
SPI1_MOSI  (via drill 0.3)
  Top 0.152: IC5.31 80.35,34.05 78.5,35.9 v77.5,35.9 | v47.8,15.4 47,16.2 46.6,16.2 45.58,17.22 IC4.32
  Bottom 0.152: v77.5,35.9 76.3,35.9 62.6,22.2 57.2,22.2 56.5,21.5 52.5,21.5 47.7,16.6 v47.8,15.4
SPI1_NSS  (via drill 0.3)
  Top 0.152: IC5.29 80.45,35.05 78.3,37.2 v77.5,37.2 | v41.7,33.1 40.25,34.55 IC4.77
  Bottom 0.152: v77.5,37.2 76.4,37.2 | 76.3,37.2 76.4,37.2 | 76.4,37.2 62.3,23.1 56.7,23.1 56.1,22.5 49.5,22.5 41.7,30.3 v41.7,33.1
SPI1_SCK  (via drill 0.3)
  Top 0.152: IC5.30 80.45,34.55 78.5,36.5 v78.2,36.5 | 44.98,16.52 IC4.30 46.34,15 v46.4,15
  Bottom 0.152: v78.2,36.5 76.3,36.5 62.4,22.6 57,22.6 56.3,21.9 52.3,21.9 46.4,16 v46.4,15
SWCLK  (via drill 0.3)
  Top 0.152: v41.2,35.7 40.59,35.09 IC4.76
  Bottom 0.152: J2.4 58.87,39.4 51.8,39.4 48.1,35.7 v41.2,35.7
SWDIO  (via drill 0.3)
  Top 0.152: v46.3,34.5 45.14,34.5 IC4.72
  Bottom 0.152: J2.2 58,39 52.1,39 48.4,35.3 47.1,35.3 v46.3,34.5
SWO  (via drill 0.3)
  Top 0.152: v34.8,31.5 v34.8,31.49 IC4.89
  Bottom 0.152: J2.6 59.74,39.8 51.5,39.8 48.3,36.6 40.9,36.6 40.1,35.8 39.1,35.8 v34.8,31.5
USB_D_N
  Top 0.152: IC4.70 45.18,33.08 44.5,32.4 44.22,32.4 36.66,24.85 11.75,24.85 10.7,25.9 10.7,27.4 11.5,28.2 11.5,28.21 R2.2
USB_D_P
  Top 0.152: IC4.71 44.83,33.44 36.48,25.2 14.3,25.2 13.7,25.7 13.7,26.8 13.3,27.2 13.1,27.2 12.7,26.8 12.7,25.6 12.3,25.2 12.1,25.2 11.4,25.9 11.4,26.74 R3.2

### Text on the board
Bottom: B.Biesenbach 2014
tPlace: DABStick Eval V0.1 | NRST | SWDIO | SWCLK | SWO | nc | GND | +5V | nc | nc | 3V3 | GND | GND | A+ | A- | B+ | B-
tDocu: GND | GND | 3V3 | 5V | 5V | PE1 | PB5 | PD7 | PD5 | PD2 | PD0 | PA10 | PA8 | PC8 | PD15 | PD13 | PD11 | PD9 | PB15 | PB13 | 5V | 5V | GND | GND | 3V3 | PE0 | PB4 | PD6 | PD3 | PD1 | PA9 | PC9 | PC6 | PD8 | PC11 | PD14 | PD12 | PD10 | PB14 | PE3 | PE5 | PC13 | PC15 | PC1 | PA1 | PA3 | GND | GND | PC5 | PB1 | PE7 | PE9 | PE11 | PE13 | PE15 | PB11 | 3V3 | GND | PE2 | PE4 | PE6 | PC0 | PC2 | PA0 | PA2 | GND | GND | PC4 | PB0 | PB2 | PE8 | GND | 3V3 | GND | PC14 | PE10 | PE12 | PE14